# Altium project Zynq-Video-Board-Rev-1.2.PrjPCB (part 1 of 2)
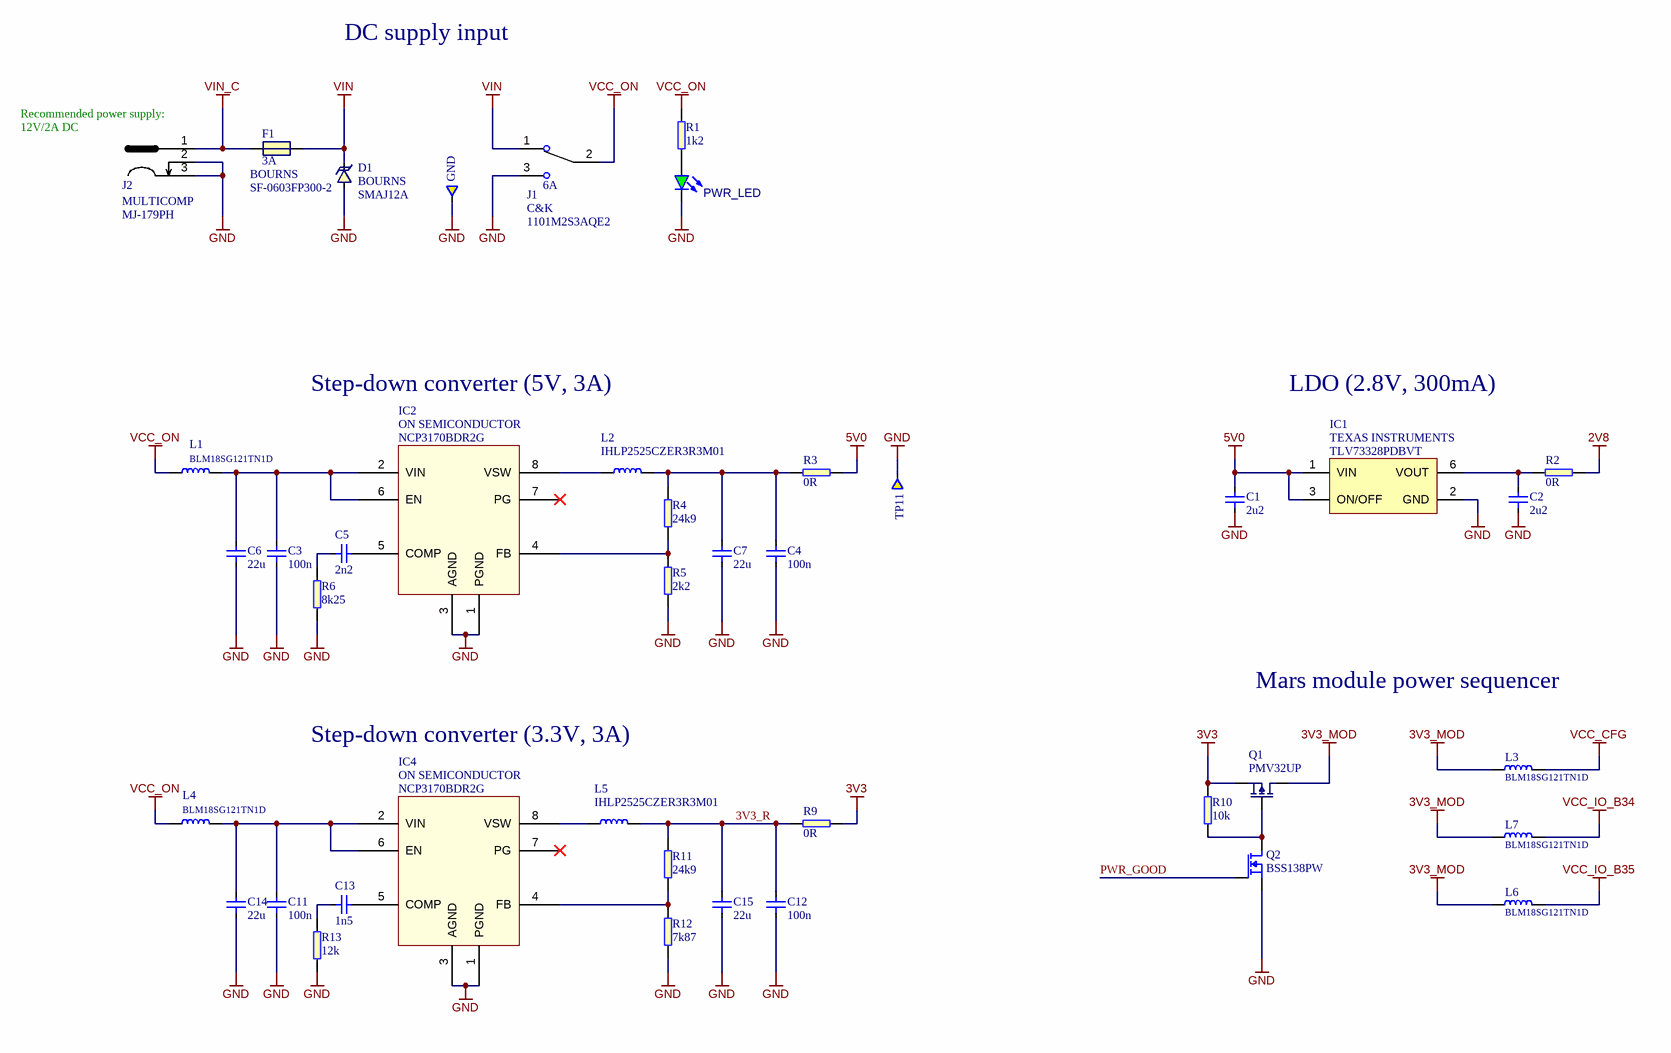
[diagram p0: [1]_Power Supply.SchDoc]
AM_Revision: 1.2; AM_Title: Zynq Video Board
9 sheets, 231 parts. Net scope: global (net labels, ports and power ports of the same name join across sheets).
Board file: Zynq-Video-Board.PcbDoc
Sheets:
  [1]_Power Supply.SchDoc
  [2]_Ethernet_SDCard.SchDoc
  [3]_SO-DIMM.SchDoc
  [4]_USB.SchDoc
  [5]_HDMI.SchDoc
  [6]_Debug.SchDoc
  [7]_CSI.SchDoc
  [8]_Peripherals.SchDoc
  [9]_ID_Serial.SchDoc

## Sheet [1]_Power Supply.SchDoc
size A3; DocumentNumber: 1; SheetNumber: 1; SheetTotal: 9; PageSetup: Record=PageOptions|CenterHorizontal=True|CenterVertical=True|PrintScale=0.97|XCorrection=1.00|YCorrection=1.00|PrintKind=1|BorderSize=5000000|LeftOffset=0|BottomOffset=0|Orientation=2|PaperLength=2970|PaperWidth=2100|Scale=100|PaperSource=7|PrintQuality=600|MediaType=1|DitherType=10|PaperKind=A4|PrintScaleMode=1

### Parts
C1  2u2  [0603]
C2  2u2  [0603]
C3  100n  [0402]
C4  100n  [0402]
C5  2n2  [0402]
C6  22u  [0805]
C7  22u  [0805]
C11  100n  [0402]
C12  100n  [0402]
C13  1n5  [0402]
C14  22u  [0805]
C15  22u  [0805]
D1  SMAJ12A  Manufacturer: BOURNS  [DO-214AA]
F1  3A  Manufacturer: BOURNS  Part Symbol: SF-0603FP300-2  [0603]
GND  Testpad  [TP-R-2]  (value not drawn)  (no BOM)
IC1  TLV73328PDBVT  Manufacturer: TEXAS INSTRUMENTS  [SOT23-5N]
IC2  NCP3170BDR2G  Manufacturer: ON SEMICONDUCTOR  [SOIC-8]
IC4  NCP3170BDR2G  Manufacturer: ON SEMICONDUCTOR  [SOIC-8]
J1  6A  Manufacturer: C&K  [1101M2S3AQE2]
J2  Manufacturer: MULTICOMP  Part Symbol: MJ-179PH  [DC_SOCKET]
L1  BLM18SG121TN1D  [0603]
L2  IHLP2525CZER3R3M01  [IHLP-2525CZ-01]
L3  BLM18SG121TN1D  [0603]
L4  BLM18SG121TN1D  [0603]
L5  IHLP2525CZER3R3M01  [IHLP-2525CZ-01]
L6  BLM18SG121TN1D  [0603]
L7  BLM18SG121TN1D  [0603]
PWR_LED  KPT-1608SGC  [LED0603]  (value not drawn)
Q1  PMV32UP  [SOT-23]
Q2  BSS138PW  [SC70-3]
R1  1k2  [0402]
R2  0R  [0603]
R3  0R  [0603]
R4  24k9  [0402]
R5  2k2  [0402]
R6  8k25  [0402]
R9  0R  [0603]
R10  10k  [0402]
R11  24k9  [0402]
R12  7k87  [0402]
R13  12k  [0402]
TP11  Testpad  [TP-R-2]  (value not drawn)  (no BOM)

### Nets
2V8: R2.2
3V3: Q1.2(S) R9.2 R10.2
3V3_MOD: L3.1 L6.1 L7.1 Q1.3(D)
5V0: C1.2 IC1.1(VIN) IC1.3(ON/OFF) R3.2
GND: C1.1 C2.1 C3.1 C4.1 C6.1 C7.1 C11.1 C12.1 C14.1 C15.1 D1.A GND.1 IC1.2(GND) IC2.1(PGND) IC2.3(AGND) IC4.1(PGND) IC4.3(AGND) J1.3 J2.2 J2.3 PWR_LED.K Q2.2(S) R5.1 R6.1 R12.1 R13.1 TP11.1
VCC_CFG: L3.2
VCC_IO_B34: L7.2
VCC_IO_B35: L6.2
VCC_ON: J1.2 L1.1 L4.1 R1.2
VIN: D1.C F1.2 J1.1
VIN_C: F1.1 J2.1
3V3_R: C12.2 C15.2 L5.2 R9.1 R11.2
PWR_GOOD: Q2.1(G)
NetC2_2: C2.2 IC1.6(VOUT) R2.1
NetC3_2: C3.2 C6.2 IC2.2(VIN) IC2.6(EN) L1.2
NetC4_2: C4.2 C7.2 L2.2 R3.1 R4.2
NetC5_1: C5.1 R6.2
NetC5_2: C5.2 IC2.5(COMP)
NetC11_2: C11.2 C14.2 IC4.2(VIN) IC4.6(EN) L4.2
NetC13_1: C13.1 R13.2
NetC13_2: C13.2 IC4.5(COMP)
NetIC2_4: IC2.4(FB) R4.1 R5.2
NetIC2_8: IC2.8(VSW) L2.1
NetIC4_4: IC4.4(FB) R11.1 R12.2
NetIC4_8: IC4.8(VSW) L5.1
NetPWR_LED_A: PWR_LED.A R1.1
NetQ1_1: Q1.1(G) Q2.3(D) R10.1

Not connected (* = marked no-connect by the designer): IC2 7(PG)*; IC4 7(PG)*

### Notes on the sheet
- DC supply input
- (near J2) Recommended power supply:
- 12V/2A DC
- Step-down converter (5V, 3A)
- LDO (2.8V, 300mA)
- Mars module power sequencer
- Step-down converter (3.3V, 3A)
- Title:
- Size:
- Date:
- A3
- Revision:
- Page:
- of
- Antmicro Ltd.
- File:
- www.antmicro.com

### Library data of the parts
C1 C2 = C_2u2_0603: MLCC SMT Capacitor 2u2F 0603; Manufacturer: TDK; Part Symbol: C1608X5R1V225K080AC; Voltage: 35V; Tolerance: +-10%; Part Number: C_2u2_0603; Value: 2u2
C3 C4 C11 C12 = C_100n_0402: MLCC SMT Capacitor 100nF 0402; Manufacturer: MULTICOMP; Part Symbol: MC0402X104M100CT; Voltage: 10V; Tolerance: +-20%; Part Number: C_100n_0402; Value: 100n
C5 = C_2n2_0402: MLCC SMT Capacitor 2n2 0402; Manufacturer: KEMET; Part Symbol: C0402C222J3GACTU; Voltage: 25V; Tolerance: +-5%; Part Number: C_2n2_0402; Value: 2n2
C6 C7 C14 C15 = C_22u_0805: MLCC SMT Capacitor 22uF 0805; Manufacturer: MULTICOMP; Part Symbol: MC0805X226M6R3CT; Voltage: 6.3V; Tolerance: +-20%; Part Number: C_22u_0805; Value: 22u
C13 = C_1n5_0402: MLCC SMT Capacitor 1.5 nF 0402; Manufacturer: WURTH ELEKTRONIK; Part Symbol: 885012205007; Voltage: 10V; Tolerance: +-10%; Part Number: C_1n5_0402; Value: 1n5
D1 = TVS_UNIDIR: DIODE, TVS, 12V, 400W; Part Number: SMAJ12A; Value: SMAJ12A; Part Symbol: SMAJ12A
F1 = Fuse: Fuse, Surface Mount,  SinglFuse SF-0603FP Series, 3 A, 32 VDC, Fast Acting, 0603; Part Number: SF-0603FP300-2; Value: 3A
GND TP11 = Testpad: Testpad, round, 2mm; Part Number: TP-R-2
IC1 = TLV73328PDBVT: Capacitor-Free, 300-mA, Low-Dropout Regulator with Foldback Current Limit for Portable Devices; Part Number: TLV73328PDBVT; Value: TLV73328PDBVT; Part Symbol: TLV73328PDBVT
IC2 IC4 = NCP3170BDR2G: DC-DC buck (step-down), reg., 4.5V-18Vin, Vou 1.25V-5V/3A, 1 MHz, SOIC-8; Part Number: NCP3170BDR2G; Value: NCP3170BDR2G; Part Symbol: NCP3170BDR2G
J1 = 1101M2S3AQE2: single-pole double-throw (SPDT) PC mount vertical Miniature Slide Switch with right angle through-hole termination; Part Number: SPDT Switch; Value: 6A; Part Symbol: 1101M2S3AQE2
J2 = DC_SOCKET: Part Number: DC_SOCKET
L1 L3 L4 L6 L7 = BLM18SG121TN1D: FERRITE BEAD, 0.025OHM, 3A, 0603; Manufacturer: MURATA; Part Number: BLM18SG121TN1D; Value: BLM18SG121TN1D; Part Symbol: BLM18SG121TN1D
L2 L5 = Inductor Power: 3.3 µH, ± 20%, Shielded, 0.02 ohm, 8 A; Manufacturer: VISHAY; Part Number: IHLP2525CZER3R3M01; Value: IHLP2525CZER3R3M01; Part Symbol: IHLP2525CZER3R3M01
PWR_LED = LED: LED Green 0603 case; Part Number: LED_G; Manufacturer: KINGBRIGHT; Value: KPT-1608SGC; Part Symbol: KPT-1608SGC
Q1 = PMOS: P CH, 20V, 4A; Manufacturer: NXP; Part Number: PMV32UP; Value: PMV32UP; Part Symbol: PMV32UP
Q2 = NMOS: MOSFET, N CH, 60V, 0.2A; Manufacturer: NXP; Value: BSS138PW; Part Number: BSS138PW; Part Symbol: BSS138PW
R1 = R_1k2_0402: SMT Resistor 1k2 0402; Manufacturer: PANASONIC; Part Symbol: ERJ2RKF1201X; Tolerance: 1%; Part Number: R_1k2_0402; Value: 1k2
R2 R3 R9 = R_0R_0603: SMT Resistor 0R 0603; Manufacturer: BOURNS; Part Symbol: CR0603-J/-000ELF; Tolerance: 5%; Part Number: R_0R_0603; Value: 0R
R4 R11 = R_24k9_0402: SMT Resistor 24k9 0402; Manufacturer: WALSIN; Part Symbol: WR04X2492FTL; Tolerance: 1%; Part Number: R_24k9_0402; Value: 24k9
R5 = R_4k7_0402: SMT Resistor 4k7 0402; Manufacturer: PANASONIC ELECTRONIC COMPONENTS; Part Symbol: ERJ2GEJ472X; Tolerance: 5%; Part Number: R_4k7_0402; Value: 2k2
R6 = R_8k25_0402: SMT Resistor 8k25 0402; Manufacturer: PANASONIC; Part Symbol: ERJ2RKF8251X; Tolerance: 1%; Part Number: R_8k25_0402; Value: 8k25
R10 = R_10k_0402: SMT Resistor 10k 0402; Manufacturer: MULTICOMP; Part Symbol: MCMR04X1002FTL; Tolerance: 1%; Part Number: R_10k_0402; Value: 10k
R12 = R_7k87_0402: SMT Resistor 7k87 0402; Manufacturer: MULTICOMP; Part Symbol: MCMR04X7871FTL; Tolerance: 1%; Part Number: R_7k87_0402; Value: 7k87
R13 = R_12k_0402: SMT Resistor 12k 0402; Manufacturer: VISHAY; Part Symbol: CRCW040212K0FKEDHP; Tolerance: 1%; Part Number: R_12k_0402; Value: 12k

## Sheet [2]_Ethernet_SDCard.SchDoc
size A3; DocumentNumber: 2; SheetNumber: 2; SheetTotal: 9; PageSetup: Record=PageOptions|CenterHorizontal=True|CenterVertical=True|PrintScale=0.97|XCorrection=1.00|YCorrection=1.00|PrintKind=1|BorderSize=5000000|LeftOffset=0|BottomOffset=0|Orientation=2|PaperLength=2970|PaperWidth=2100|Scale=100|PaperSource=7|PrintQuality=600|MediaType=1|DitherType=10|PaperKind=A4|PrintScaleMode=1
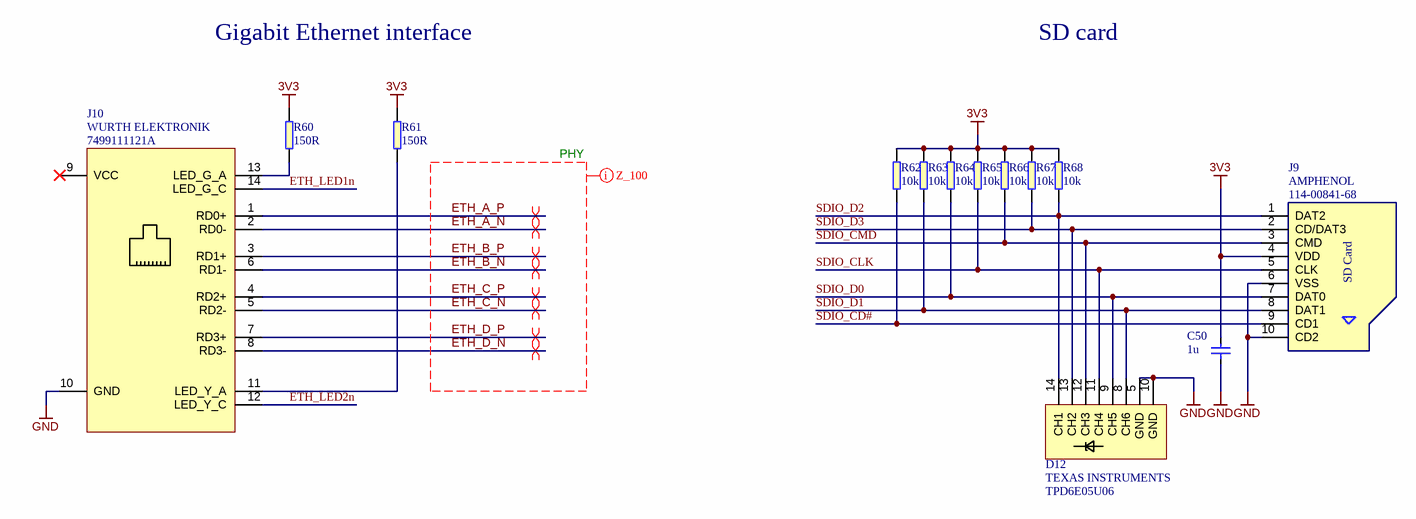
[diagram p1: [2]_Ethernet_SDCard.SchDoc]

### Parts
C50  1u  [0603]
D12  Manufacturer: TEXAS INSTRUMENTS  [TPD6E05U06_PASS]  (hidden comment: TPD6E05U06)
J9  Manufacturer: AMPHENOL  [114-00841-68]  (hidden comment: 114-00841-68)
J10  Manufacturer: WURTH ELEKTRONIK  [WE_7499111121A]  (hidden comment: 7499111121A)
R60  150R  [0402]
R61  150R  [0402]
R62  10k  [0402]
R63  10k  [0402]
R64  10k  [0402]
R65  10k  [0402]
R66  10k  [0402]
R67  10k  [0402]
R68  10k  [0402]

### Nets
3V3: C50.2 J9.4(VDD) R60.2 R61.2 R62.2 R63.2 R64.2 R65.2 R66.2 R67.2 R68.2
GND: C50.1 D12.5(GND) D12.10(GND) J9.6(VSS) J9.10(CD2) J10.10(GND)
ETH_A_N: J10.2(RD0-)
ETH_A_P: J10.1(RD0+)
ETH_B_N: J10.6(RD1-)
ETH_B_P: J10.3(RD1+)
ETH_C_N: J10.5(RD2-)
ETH_C_P: J10.4(RD2+)
ETH_D_N: J10.8(RD3-)
ETH_D_P: J10.7(RD3+)
ETH_LED1n: J10.14(LED_G_C)
ETH_LED2n: J10.12(LED_Y_C)
SDIO_CD#: J9.9(CD1) R62.1
SDIO_CLK: D12.11(CH4) J9.5(CLK) R65.1
SDIO_CMD: D12.12(CH3) J9.3(CMD) R66.1
SDIO_D0: D12.9(CH5) J9.7(DAT0) R64.1
SDIO_D1: D12.8(CH6) J9.8(DAT1) R63.1
SDIO_D2: D12.14(CH1) J9.1(DAT2) R68.1
SDIO_D3: D12.13(CH2) J9.2(CD/DAT3) R67.1
NetJ10_11: J10.11(LED_Y_A) R61.1
NetJ10_13: J10.13(LED_G_A) R60.1

Not connected (* = marked no-connect by the designer): J10 9(VCC)*

### Layout directives
differential pair: ETH_A_N, ETH_A_P, ETH_B_N, ETH_B_P, ETH_C_N, ETH_C_P, ETH_D_N, ETH_D_P
Z_100: 100: ETH_A_N, ETH_A_P, ETH_B_N, ETH_B_P, ETH_C_N, ETH_C_P, ETH_D_N, ETH_D_P

### Notes on the sheet
- Gigabit Ethernet interface
- SD card
- PHY
- Title:
- Size:
- Date:
- A3
- Revision:
- Page:
- of
- Antmicro Ltd.
- File:
- www.antmicro.com
- (in symbol Micro_SD) SD Card

### Library data of the parts
C50 = C_1u_0603: MLCC SMT Capacitor 1u 0603; Manufacturer: MULTICOMP; Part Symbol: MC0603X105M6R3CT; Tolerance: +-20%; Voltage: 6.3V; Value: 1u; Part Number: C_1u_0603
D12 = TPD6E05U06: ESD Suppressors 6-CH Pass through layout; Part Symbol: TPD6E05U06RVZR; Part Number: TPD6E05U06_PASS; Value: TPD6E05U06
J9 = Micro_SD: Micro SD card holder; Part Number: AMP-114-00841-68; Value: 114-00841-68; Part Symbol: 114-00841-68
J10 = WE_7499111121A: CONN MAGJACK 1PORT 1000 BASE-T; Part Number: WE_7499111121A; Value: 7499111121A; Part Symbol: 7499111121A
R60 R61 = R_150R_0402: SMT Resistor 150R_0402; Manufacturer: VISHAY; Part Symbol: CRCW0402150RFKED; Tolerance: 1%; Part Number: R_150R_0402; Value: 150R
R62-R68 = R_10k_0402: as R10 on sheet [1]_Power Supply; Value: 10k; Part Number: R_10k_0402

## Sheet [3]_SO-DIMM.SchDoc
size A3; DocumentNumber: 3; SheetNumber: 3; SheetTotal: 9; PageSetup: Record=PageOptions|CenterHorizontal=True|CenterVertical=True|PrintScale=0.97|XCorrection=1.00|YCorrection=1.00|PrintKind=1|BorderSize=5000000|LeftOffset=0|BottomOffset=0|Orientation=2|PaperLength=2970|PaperWidth=2100|Scale=100|PaperSource=7|PrintQuality=600|MediaType=1|DitherType=10|PaperKind=A4|PrintScaleMode=1
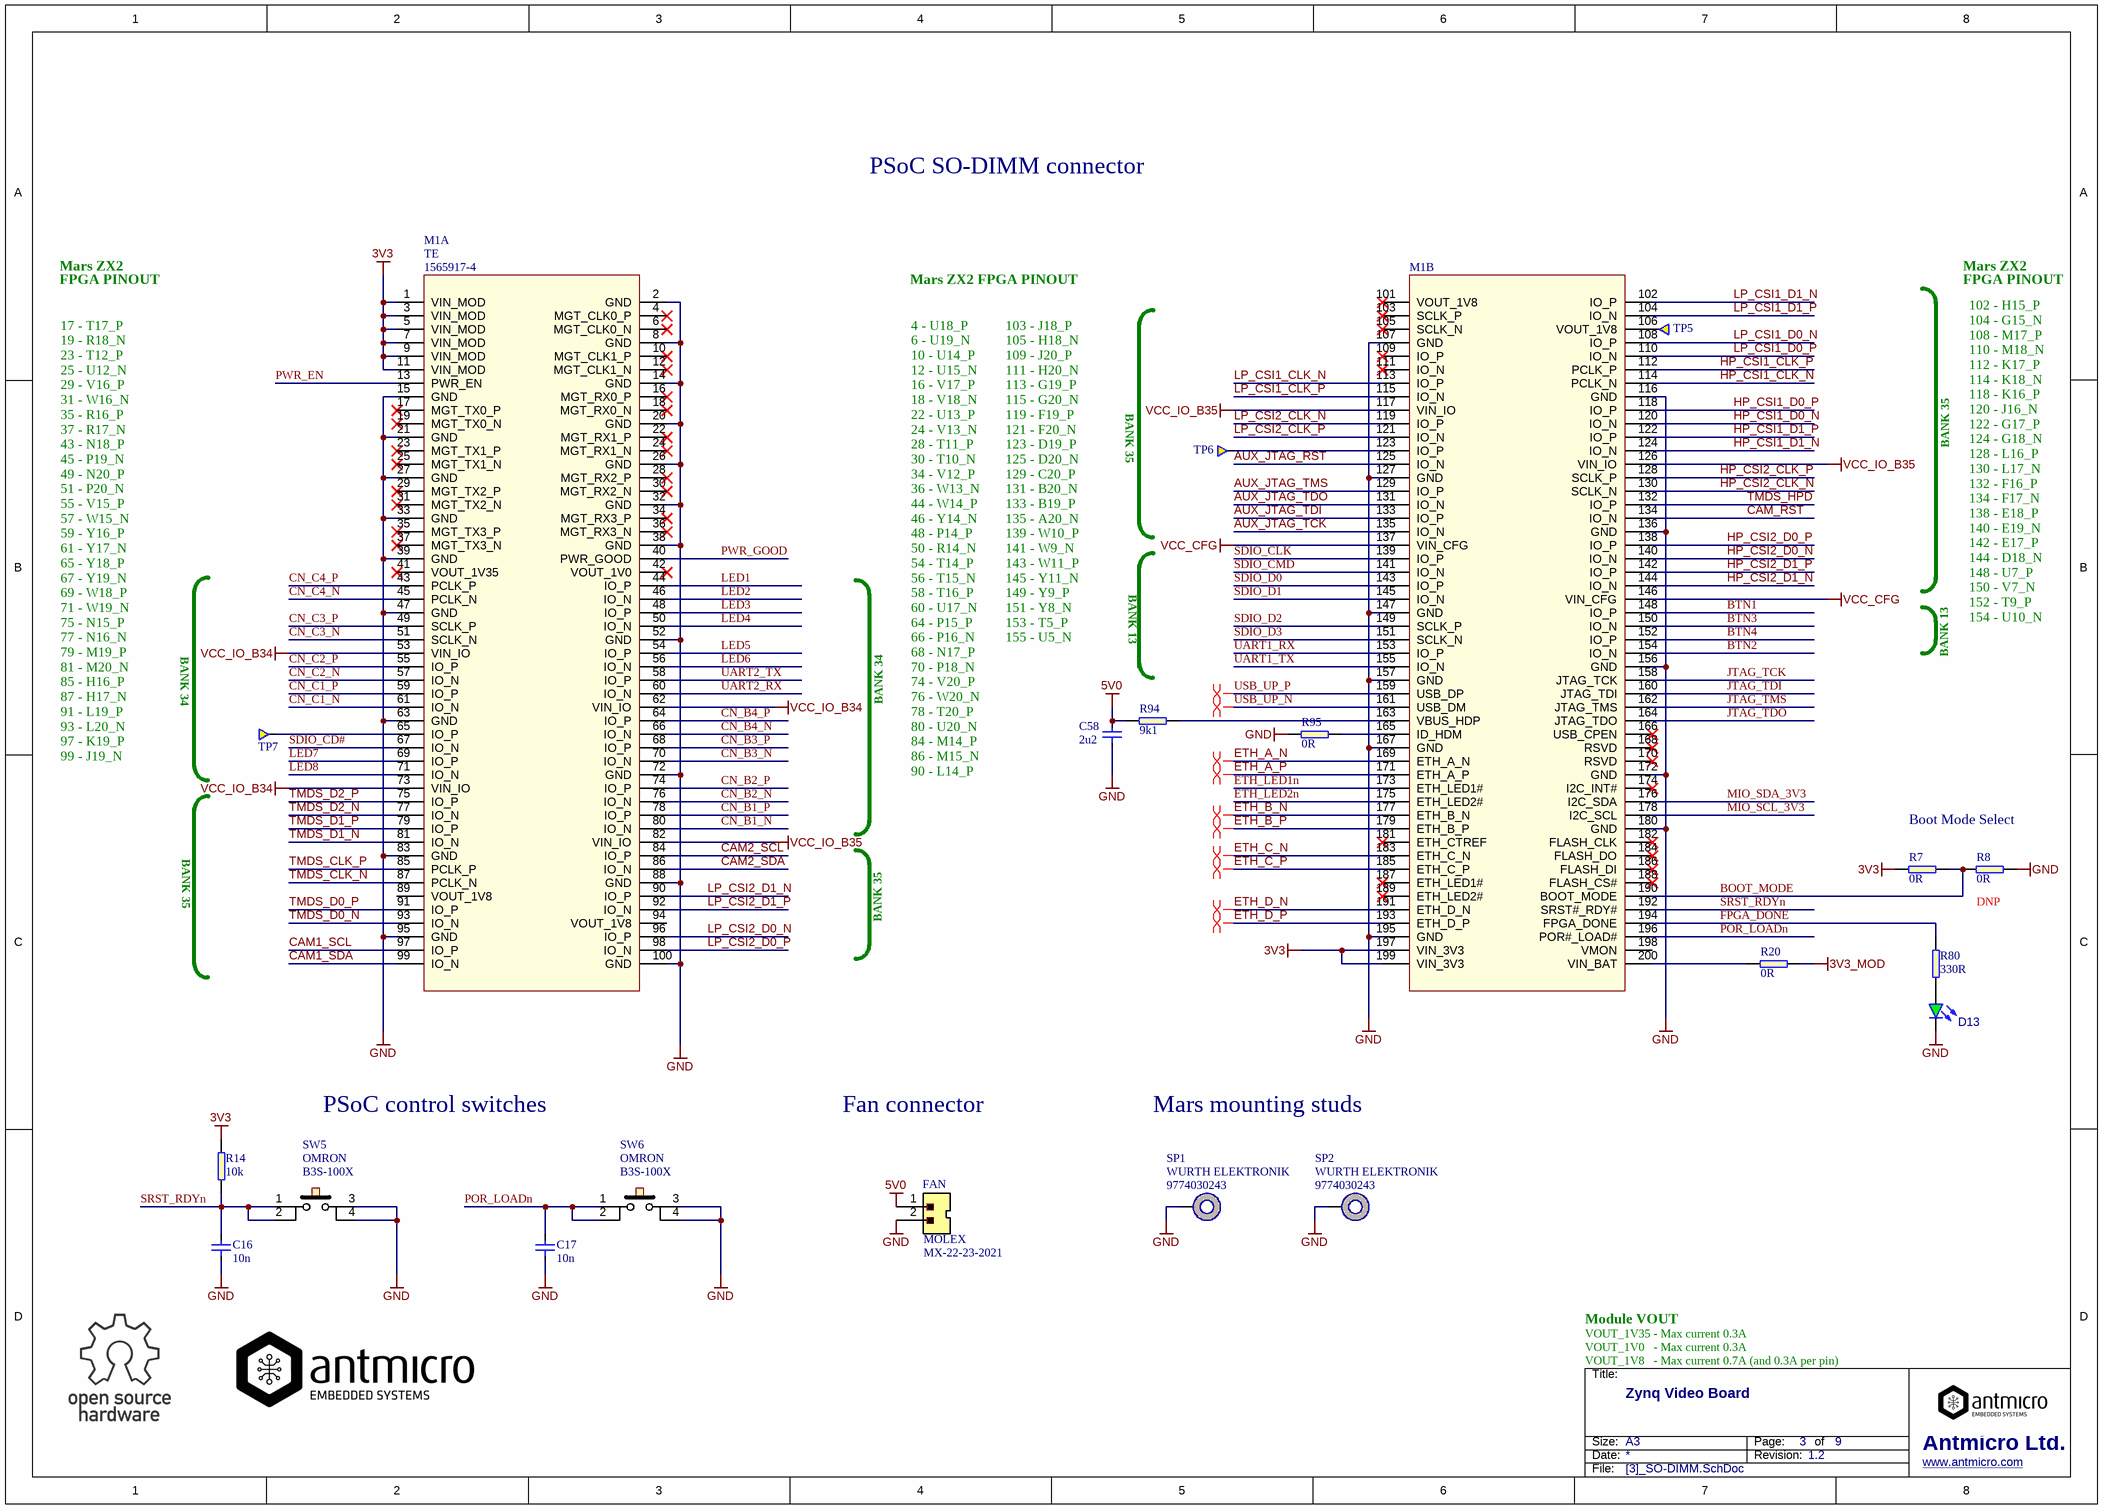
[diagram p2: [3]_SO-DIMM.SchDoc]

### Parts
C16  10n  [0402]
C17  10n  [0402]
C58  2u2  [0603]
D13  KPT-1608SGC  [LED0603]  (value not drawn)
FAN  Manufacturer: MOLEX  [molex_2223-2021]  (hidden comment: MX-22-23-2021)
M1  Manufacturer: TE  [TE_1565917-4]  (hidden comment: 1565917-4)  (parts A,B of 2)
R7  0R  [0402]
R8  0R  [0402]
R14  10k  [0402]
R20  0R  [0402]
R80  330R  [0402]
R94  9k1  [0402]
R95  0R  [0402]
SP1  9774030243  Manufacturer: WURTH ELEKTRONIK  [M2-3mm]
SP2  9774030243  Manufacturer: WURTH ELEKTRONIK  [M2-3mm]
SW5  Manufacturer: OMRON  [B3S-100X]  (hidden comment: B3S-100X)
SW6  Manufacturer: OMRON  [B3S-100X]  (hidden comment: B3S-100X)
TP5  Testpad  [TP-R-2]  (value not drawn)  (no BOM)
TP6  Testpad  [TP-R-2]  (value not drawn)  (no BOM)
TP7  Testpad  [TP-R-2]  (value not drawn)  (no BOM)

### Nets
3V3: M1.1(VIN_MOD) M1.3(VIN_MOD) M1.5(VIN_MOD) M1.7(VIN_MOD) M1.9(VIN_MOD) M1.11(VIN_MOD) M1.197(VIN_3V3) M1.199(VIN_3V3) R7.1 R14.1
3V3_MOD: R20.2
5V0: C58.2 FAN.1 R94.1
GND: C16.1 C17.1 C58.1 D13.K FAN.2 M1.2(GND) M1.8(GND) M1.14(GND) M1.15(GND) M1.20(GND) M1.21(GND) M1.26(GND) M1.27(GND) M1.32(GND) M1.33(GND) M1.38(GND) M1.39(GND) M1.47(GND) M1.52(GND) M1.63(GND) M1.72(GND) M1.83(GND) M1.88(GND) M1.95(GND) M1.100(GND) M1.107(GND) M1.116(GND) M1.127(GND) M1.136(GND) M1.147(GND) M1.156(GND) M1.157(GND) M1.167(GND) M1.172(GND) M1.180(GND) M1.195(GND) R8.2 R95.1 SP1.1 SP2.1 SW5.3 SW5.4 SW6.3 SW6.4
VCC_CFG: M1.137(VIN_CFG) M1.146(VIN_CFG)
VCC_IO_B34: M1.53(VIN_IO) M1.62(VIN_IO) M1.73(VIN_IO)
VCC_IO_B35: M1.82(VIN_IO) M1.117(VIN_IO) M1.126(VIN_IO)
AUX_JTAG_RST: M1.125(IO_N)
AUX_JTAG_TCK: M1.135(IO_N)
AUX_JTAG_TDI: M1.133(IO_P)
AUX_JTAG_TDO: M1.131(IO_N)
AUX_JTAG_TMS: M1.129(IO_P)
BOOT_MODE: M1.190(BOOT_MODE) R7.2 R8.1
BTN1: M1.148(IO_P)
BTN2: M1.154(IO_N)
BTN3: M1.150(IO_N)
BTN4: M1.152(IO_P)
CAM1_SCL: M1.97(IO_P)
CAM1_SDA: M1.99(IO_N)
CAM2_SCL: M1.84(IO_P)
CAM2_SDA: M1.86(IO_N)
CAM_RST: M1.134(IO_N)
CN_B1_N: M1.80(IO_N)
CN_B1_P: M1.78(IO_P)
CN_B2_N: M1.76(IO_N)
CN_B2_P: M1.74(IO_P)
CN_B3_N: M1.70(IO_N)
CN_B3_P: M1.68(IO_P)
CN_B4_N: M1.66(IO_N)
CN_B4_P: M1.64(IO_P)
CN_C1_N: M1.61(IO_N)
CN_C1_P: M1.59(IO_P)
CN_C2_N: M1.57(IO_N)
CN_C2_P: M1.55(IO_P)
CN_C3_N: M1.51(SCLK_N)
CN_C3_P: M1.49(SCLK_P)
CN_C4_N: M1.45(PCLK_N)
CN_C4_P: M1.43(PCLK_P)
ETH_A_N: M1.169(ETH_A_N)
ETH_A_P: M1.171(ETH_A_P)
ETH_B_N: M1.177(ETH_B_N)
ETH_B_P: M1.179(ETH_B_P)
ETH_C_N: M1.183(ETH_C_N)
ETH_C_P: M1.185(ETH_C_P)
ETH_D_N: M1.191(ETH_D_N)
ETH_D_P: M1.193(ETH_D_P)
ETH_LED1n: M1.173(ETH_LED1#)
ETH_LED2n: M1.175(ETH_LED2#)
FPGA_DONE: M1.194(FPGA_DONE) R80.2
HP_CSI1_CLK_N: M1.114(PCLK_N)
HP_CSI1_CLK_P: M1.112(PCLK_P)
HP_CSI1_D0_N: M1.120(IO_N)
HP_CSI1_D0_P: M1.118(IO_P)
HP_CSI1_D1_N: M1.124(IO_N)
HP_CSI1_D1_P: M1.122(IO_P)
HP_CSI2_CLK_N: M1.130(SCLK_N)
HP_CSI2_CLK_P: M1.128(SCLK_P)
HP_CSI2_D0_N: M1.140(IO_N)
HP_CSI2_D0_P: M1.138(IO_P)
HP_CSI2_D1_N: M1.144(IO_N)
HP_CSI2_D1_P: M1.142(IO_P)
JTAG_TCK: M1.158(JTAG_TCK)
JTAG_TDI: M1.160(JTAG_TDI)
JTAG_TDO: M1.164(JTAG_TDO)
JTAG_TMS: M1.162(JTAG_TMS)
LED1: M1.44(IO_P)
LED2: M1.46(IO_N)
LED3: M1.48(IO_P)
LED4: M1.50(IO_N)
LED5: M1.54(IO_P)
LED6: M1.56(IO_N)
LED7: M1.69(IO_P)
LED8: M1.71(IO_N)
LP_CSI1_CLK_N: M1.113(IO_P)
LP_CSI1_CLK_P: M1.115(IO_N)
LP_CSI1_D0_N: M1.108(IO_P)
LP_CSI1_D0_P: M1.110(IO_N)
LP_CSI1_D1_N: M1.102(IO_P)
LP_CSI1_D1_P: M1.104(IO_N)
LP_CSI2_CLK_N: M1.119(IO_P)
LP_CSI2_CLK_P: M1.121(IO_N)
LP_CSI2_D0_N: M1.96(IO_P)
LP_CSI2_D0_P: M1.98(IO_N)
LP_CSI2_D1_N: M1.90(IO_P)
LP_CSI2_D1_P: M1.92(IO_N)
MIO_SCL_3V3: M1.178(I2C_SCL)
MIO_SDA_3V3: M1.176(I2C_SDA)
POR_LOADn: C17.2 M1.196(POR#_LOAD#) SW6.1 SW6.2
PWR_EN: M1.13(PWR_EN)
PWR_GOOD: M1.40(PWR_GOOD)
SDIO_CD#: M1.67(IO_N)
SDIO_CLK: M1.139(IO_P)
SDIO_CMD: M1.141(IO_N)
SDIO_D0: M1.143(IO_P)
SDIO_D1: M1.145(IO_N)
SDIO_D2: M1.149(SCLK_P)
SDIO_D3: M1.151(SCLK_N)
SRST_RDYn: C16.2 M1.192(SRST#_RDY#) R14.2 SW5.1 SW5.2
TMDS_CLK_N: M1.87(PCLK_N)
TMDS_CLK_P: M1.85(PCLK_P)
TMDS_D0_N: M1.93(IO_N)
TMDS_D0_P: M1.91(IO_P)
TMDS_D1_N: M1.81(IO_N)
TMDS_D1_P: M1.79(IO_P)
TMDS_D2_N: M1.77(IO_N)
TMDS_D2_P: M1.75(IO_P)
TMDS_HPD: M1.132(IO_P)
UART1_RX: M1.153(IO_P)
UART1_TX: M1.155(IO_N)
UART2_RX: M1.60(IO_N)
UART2_TX: M1.58(IO_P)
USB_UP_N: M1.161(USB_DM)
USB_UP_P: M1.159(USB_DP)
NetD13_A: D13.A R80.1
NetM1_65: M1.65(IO_P) TP7.1
NetM1_106: M1.106(VOUT_1V8) TP5.1
NetM1_123: M1.123(IO_P) TP6.1
NetM1_163: M1.163(VBUS_HDP) R94.2
NetM1_165: M1.165(ID_HDM) R95.2
NetM1_200: M1.200(VIN_BAT) R20.1

Not connected (* = marked no-connect by the designer): M1 4(MGT_CLK0_P)* 6(MGT_CLK0_N)* 10(MGT_CLK1_P)* 12(MGT_CLK1_N)* 16(MGT_RX0_P)* 17(MGT_TX0_P)* 18(MGT_RX0_N)* 19(MGT_TX0_N)* 22(MGT_RX1_P)* 23(MGT_TX1_P)* 24(MGT_RX1_N)* 25(MGT_TX1_N)* 28(MGT_RX2_P)* 29(MGT_TX2_P)* 30(MGT_RX2_N)* 31(MGT_TX2_N)* 34(MGT_RX3_P)* 35(MGT_TX3_P)* 36(MGT_RX3_N)* 37(MGT_TX3_N)* 41(VOUT_1V35)* 42(VOUT_1V0)* 89(VOUT_1V8) 94(VOUT_1V8) 101(VOUT_1V8)* 103(SCLK_P)* 105(SCLK_N)* 109(IO_P)* 111(IO_N)* 166(USB_CPEN)* 168(RSVD)* 170(RSVD)* 174(I2C_INT#)* 181(ETH_CTREF)* 182(FLASH_CLK)* 184(FLASH_DO)* 186(FLASH_DI)* 187(ETH_LED1#)* 188(FLASH_CS#)* 189(ETH_LED2#)* 198(VMON)

### Layout directives
differential pair: ETH_A_N, ETH_A_P, ETH_B_N, ETH_B_P, ETH_C_N, ETH_C_P, ETH_D_N, ETH_D_P, USB_UP_N, USB_UP_P

### Notes on the sheet
- PSoC SO-DIMM connector
- Mars ZX2
- FPGA PINOUT
- Mars ZX2 FPGA PINOUT
- BANK 35
- BANK 34
- BANK 13
- 102 - H15_P
  104 - G15_N
  108 - M17_P
  110 - M18_N
  112 - K17_P
  114 - K18_N
  118 - K16_P
  120 - J16_N
  122 - G17_P
  124 - G18_N
  128 - L16_P
  130 - L17_N
  132 - F16_P
  134 - F17_N
  138 - E18_P
  140 - E19_N
  142 - E17_P
  144 - D18_N
  148 - U7_P
  150 - V7_N
  152 - T9_P
  154 - U10_N
- 17 - T17_P
  19 - R18_N
  23 - T12_P
  25 - U12_N
  29 - V16_P
  31 - W16_N
  35 - R16_P
  37 - R17_N
  43 - N18_P
  45 - P19_N
  49 - N20_P
  51 - P20_N
  55 - V15_P
  57 - W15_N
  59 - Y16_P
  61 - Y17_N
  65 - Y18_P
  67 - Y19_N
  69 - W18_P
  71 - W19_N
  75 - N15_P
  77 - N16_N
  79 - M19_P
  81 - M20_N
  85 - H16_P
  87 - H17_N
  91 - L19_P
  93 - L20_N
  97 - K19_P
  99 - J19_N
- 4 - U18_P
  6 - U19_N
  10 - U14_P
  12 - U15_N
  16 - V17_P
  18 - V18_N
  22 - U13_P
  24 - V13_N
  28 - T11_P
  30 - T10_N
  34 - V12_P
  36 - W13_N
  44 - W14_P
  46 - Y14_N
  48 - P14_P
  50 - R14_N
  54 - T14_P
  56 - T15_N
  58 - T16_P
  60 - U17_N
  64 - P15_P
  66 - P16_N
  68 - N17_P
  70 - P18_N
  74 - V20_P
  76 - W20_N
  78 - T20_P
  80 - U20_N
  84 - M14_P
  86 - M15_N
  90 - L14_P
  92 - L15_N
  96 - K14_P
  98 - J14_N
- (near C58) 103 - J18_P
  105 - H18_N
  109 - J20_P
  111 - H20_N
  113 - G19_P
  115 - G20_N
  119 - F19_P
  121 - F20_N
  123 - D19_P
  125 - D20_N
  129 - C20_P
  131 - B20_N
  133 - B19_P
  135 - A20_N
  139 - W10_P
  141 - W9_N
  143 - W11_P
  145 - Y11_N
  149 - Y9_P
  151 - Y8_N
  153 - T5_P
  155 - U5_N
- Boot Mode Select
- (near R8) DNP
- PSoC control switches
- Fan connector
- Mars mounting studs
- Module VOUT
- VOUT_1V35 - Max current 0.3A
- VOUT_1V0   - Max current 0.3A
- VOUT_1V8   - Max current 0.7A (and 0.3A per pin)
- Title:
- Size:
- Date:
- A3
- Revision:
- Page:
- of
- Antmicro Ltd.
- File:
- www.antmicro.com

### Library data of the parts
C16 C17 = C_10n_0402: MLCC SMT Capacitor 10nF 0402; Manufacturer: AVX; Part Symbol: 04025G103ZAT2A; Voltage: 50V; Tolerance: +80% -20%; Part Number: C_10n_0402; Value: 10n
C58 = C_2u2_0603: as C1 on sheet [1]_Power Supply; Part Number: C_2u2_0603; Value: 2u2
D13 = LED: as PWR_LED on sheet [1]_Power Supply; Value: KPT-1608SGC; Part Symbol: KPT-1608SGC
FAN = molex_2223-2021: Pinhead connector with key; Part Symbol: 022232021 A-6373-02A222; Part Number: molex_2223-2021; Value: MX-22-23-2021
M1 = Mars ZX2: SODIMM Connector 200_1V8; Part Number: Mars ZX2; Part Symbol: 1565917-4; Value: 1565917-4
R7 R8 R20 R95 = R_0R_0402: SMT Resistor 0R 0402; Manufacturer: MULTICOMP; Part Symbol: MCMR04X000 PTL; Part Number: R_0R_0402; Value: 0R
R14 = R_10k_0402: as R10 on sheet [1]_Power Supply; Part Number: R_10k_0402; Value: 10k
R80 = R_330R_0402: SMT Resistor 330R 0402; Manufacturer: MULTICOMP; Part Symbol: MCMR04X3300FTL; Tolerance: 1%; Part Number: R_330R_0402; Value: 330R
R94 = R_9k1_0402: SMT Resistor 9k1 0402; Manufacturer: YAGEO; Part Symbol: RC0402FR-079K1L; Tolerance: 1%; Part Number: R_9k1_0402; Value: 9k1
SP1 SP2 = SPACER: M2x3; Part Number: WE_9774030243; Value: 9774030243; Part Symbol: 9774030243
SW5 SW6 = TACTILE_SWITCH: Tactile switch; Part Number: B3S-1002; Value: B3S-100X; Part Symbol: B3S-1002
TP5-TP7 = Testpad: Testpad, round, 2mm; Part Number: TP-R-2

## Sheet [4]_USB.SchDoc
size A3; DocumentNumber: 4; SheetNumber: 4; SheetTotal: 9; PageSetup: Record=PageOptions|CenterHorizontal=True|CenterVertical=True|PrintScale=0.97|XCorrection=1.00|YCorrection=1.00|PrintKind=1|BorderSize=5000000|LeftOffset=0|BottomOffset=0|Orientation=2|PaperLength=2970|PaperWidth=2100|Scale=100|PaperSource=7|PrintQuality=600|MediaType=1|DitherType=10|PaperKind=A4|PrintScaleMode=1
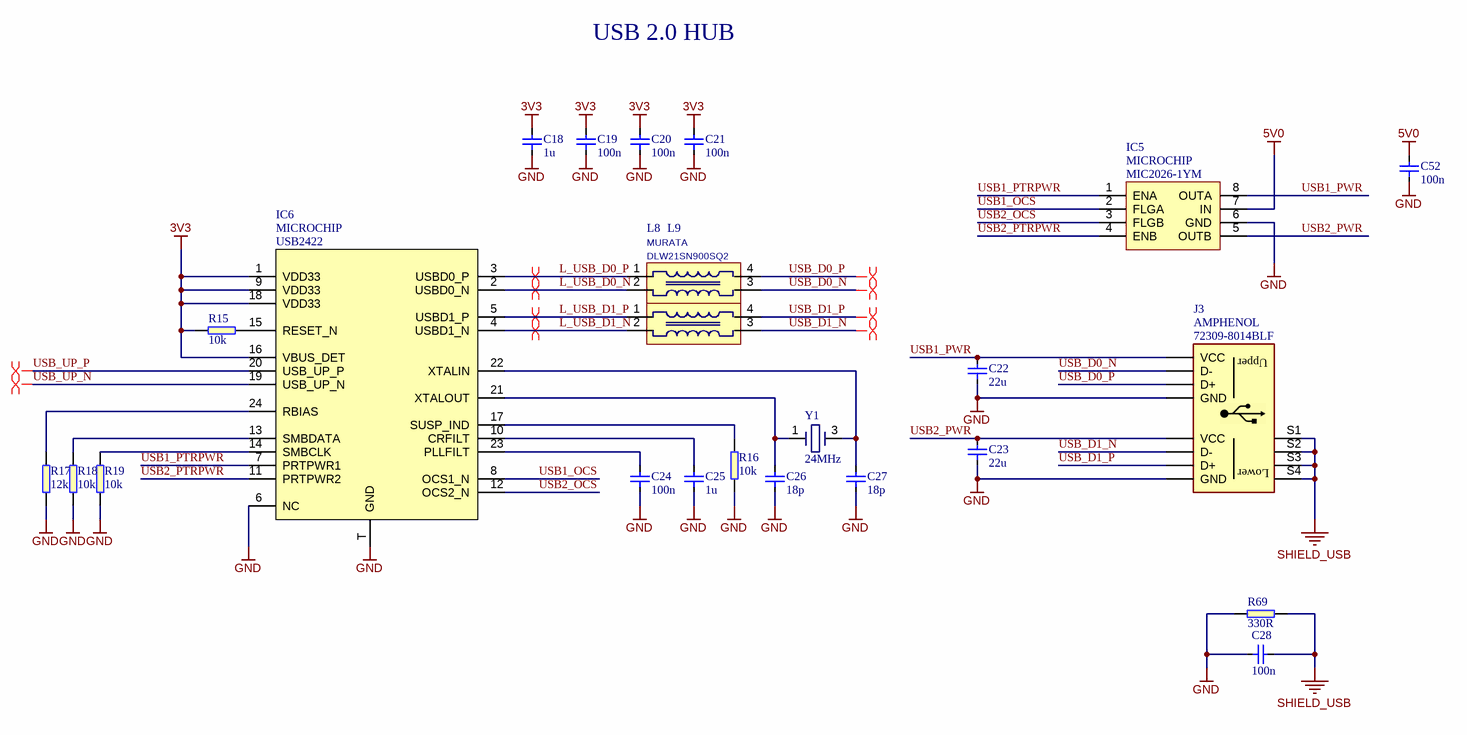
[diagram p3: [4]_USB.SchDoc]

### Parts
C18  1u  [0603]
C19  100n  [0402]
C20  100n  [0402]
C21  100n  [0402]
C22  22u  [0805]
C23  22u  [0805]
C24  100n  [0402]
C25  1u  [0603]
C26  18p  [0402]
C27  18p  [0402]
C28  100n  [0402]
C52  100n  [0402]
IC5  Manufacturer: MICROCHIP  [SOIC-8]  (hidden comment: MIC2026-1YM)
IC6  USB2422  Manufacturer: MICROCHIP  [QFN24]
J3  Manufacturer: AMPHENOL  Part Symbol: 72309-8014BLF  [T_MMMC_896-43-008-90-000000]
L8  Manufacturer: MURATA  [DLW21SN900SQ2]  (hidden comment: DLW21SN900SQ2)
L9  DLW21SN900SQ2  [DLW21SN900SQ2]  (value not drawn)
R15  10k  [0402]
R16  10k  [0402]
R17  12k  [0402]
R18  10k  [0402]
R19  10k  [0402]
R69  330R  [0402]
Y1  24MHz  [X1E0000210832]

### Nets
3V3: C18.2 C19.2 C20.2 C21.2 IC6.1(VDD33) IC6.9(VDD33) IC6.16(VBUS_DET) IC6.18(VDD33) R15.1
5V0: C52.2 IC5.7(IN)
GND: C18.1 C19.1 C20.1 C21.1 C22.1 C23.1 C24.1 C25.1 C26.1 C27.1 C28.1 C52.1 IC5.6(GND) IC6.6(NC) IC6.T(GND) J3.L4(GND) J3.U4(GND) R16.2 R17.1 R18.2 R19.2 R69.1 Y1.2 Y1.4
SHIELD_USB: C28.2 J3.S1 J3.S2 J3.S3 J3.S4 R69.2
L_USB_D0_N: IC6.2(USBD0_N) L8.2
L_USB_D0_P: IC6.3(USBD0_P) L8.1
L_USB_D1_N: IC6.4(USBD1_N) L9.2
L_USB_D1_P: IC6.5(USBD1_P) L9.1
USB1_OCS: IC5.2(FLGA) IC6.8(OCS1_N)
USB1_PTRPWR: IC5.1(ENA) IC6.7(PRTPWR1)
USB1_PWR: C22.2 IC5.8(OUTA) J3.U1(VCC)
USB2_OCS: IC5.3(FLGB) IC6.12(OCS2_N)
USB2_PTRPWR: IC5.4(ENB) IC6.11(PRTPWR2)
USB2_PWR: C23.2 IC5.5(OUTB) J3.L1(VCC)
USB_D0_N: J3.U2(D-) L8.3
USB_D0_P: J3.U3(D+) L8.4
USB_D1_N: J3.L2(D-) L9.3
USB_D1_P: J3.L3(D+) L9.4
USB_UP_N: IC6.19(USB_UP_N)
USB_UP_P: IC6.20(USB_UP_P)
NetC24_2: C24.2 IC6.23(PLLFILT)
NetC25_2: C25.2 IC6.10(CRFILT)
NetC26_2: C26.2 IC6.21(XTALOUT) Y1.1
NetC27_2: C27.2 IC6.22(XTALIN) Y1.3
NetIC6_13: IC6.13(SMBDATA) R18.1
NetIC6_14: IC6.14(SMBCLK) R19.1
NetIC6_15: IC6.15(RESET_N) R15.2
NetIC6_17: IC6.17(SUSP_IND) R16.1
NetIC6_24: IC6.24(RBIAS) R17.2

### Layout directives
differential pair: L_USB_D0_N, L_USB_D0_P, L_USB_D1_N, L_USB_D1_P, USB_D0_N, USB_D0_P, USB_D1_N, USB_D1_P, USB_UP_N, USB_UP_P

### Notes on the sheet
- USB 2.0 HUB
- Title:
- Size:
- Date:
- A3
- Revision:
- Page:
- of
- Antmicro Ltd.
- File:
- www.antmicro.com
- (in symbol USB_DOUBLE_A) Upper; Lower

### Library data of the parts
C18 C25 = C_1u_0603: MLCC SMT Capacitor 1u 0603; Manufacturer: MULTICOMP; Part Symbol: MC0603X105M6R3CT; Voltage: 6.3V; Tolerance: +-20%; Part Number: C_1u_0603; Value: 1u
C19-C21 C24 C28 C52 = C_100n_0402: as C3 on sheet [1]_Power Supply; Value: 100n; Part Number: C_100n_0402
C22 C23 = C_22u_0805: as C6 on sheet [1]_Power Supply; Part Number: C_22u_0805; Value: 22u
C26 C27 = C_18p_0402: MLCC SMT Capacitor 18pF 0402; Manufacturer: KEMET; Part Symbol: C0402C180J5GACAUTO; Voltage: 50V; Tolerance: +-5%; Part Number: C_18p_0402; Value: 18p
IC5 = MIC2026-1YM: Power Load Distribution Switch IC, Active High, 2 Outputs, 5.5 V in, 900 mA, 0.09 ohm, SOIC-8; Part Number: MIC2026-1YM; Value: MIC2026-1YM; Part Symbol: MIC2026-1YM
IC6 = USB2422: The USB2422-I/MJ is a 2-port USB 2.0 high-speed Hub Controller IC with two downstream ports for embedded USB solutions.; Part Number: USB2422; Value: USB2422; Part Symbol: USB2422-I/MJ
J3 = USB_DOUBLE_A: 8-way 2-port USB 2.0 type-A Stacked Connector with gold-plated copper alloy contacts.; Part Number: USB_DOUBLE_A
L8 = DLW21SN900SQ2: Common mode choke; Part Symbol: DLW21SN900SQ2L; Part Number: DLW21SN900SQ2; Value: DLW21SN900SQ2
L9 = DLW21SN900SQ2: Common mode choke; Manufacturer: MURATA; Part Symbol: DLW21SN900SQ2L; Part Number: DLW21SN900SQ2; Value: DLW21SN900SQ2
R15 R16 R18 R19 = R_10k_0402: as R10 on sheet [1]_Power Supply; Part Number: R_10k_0402; Value: 10k
R17 = R_12k_0402: as R13 on sheet [1]_Power Supply; Part Number: R_12k_0402; Value: 12k
R69 = R_330R_0402: as R80 on sheet [3]_SO-DIMM; Part Number: R_330R_0402; Value: 330R
Y1 = CRYSTAL_SMD_24Mhz: Crystal, 24 MHz, SMD, 3.2mm x 2.5mm, 10 ppm, 18 pF, 10 ppm, TSX-3225 Series; Part Number: CRYSTAL_24MHz_3.2mm x2.5mm; Manufacturer: EPSON; Part Symbol: X1E0000210832 TSX-3225 24MHZ; Value: 24MHz

## Sheet [5]_HDMI.SchDoc
size A3; DocumentNumber: 5; SheetNumber: 5; SheetTotal: 9; PageSetup: Record=PageOptions|CenterHorizontal=True|CenterVertical=True|PrintScale=0.97|XCorrection=1.00|YCorrection=1.00|PrintKind=1|BorderSize=5000000|LeftOffset=0|BottomOffset=0|Orientation=2|PaperLength=2970|PaperWidth=2100|Scale=100|PaperSource=7|PrintQuality=600|MediaType=1|DitherType=10|PaperKind=A4|PrintScaleMode=1
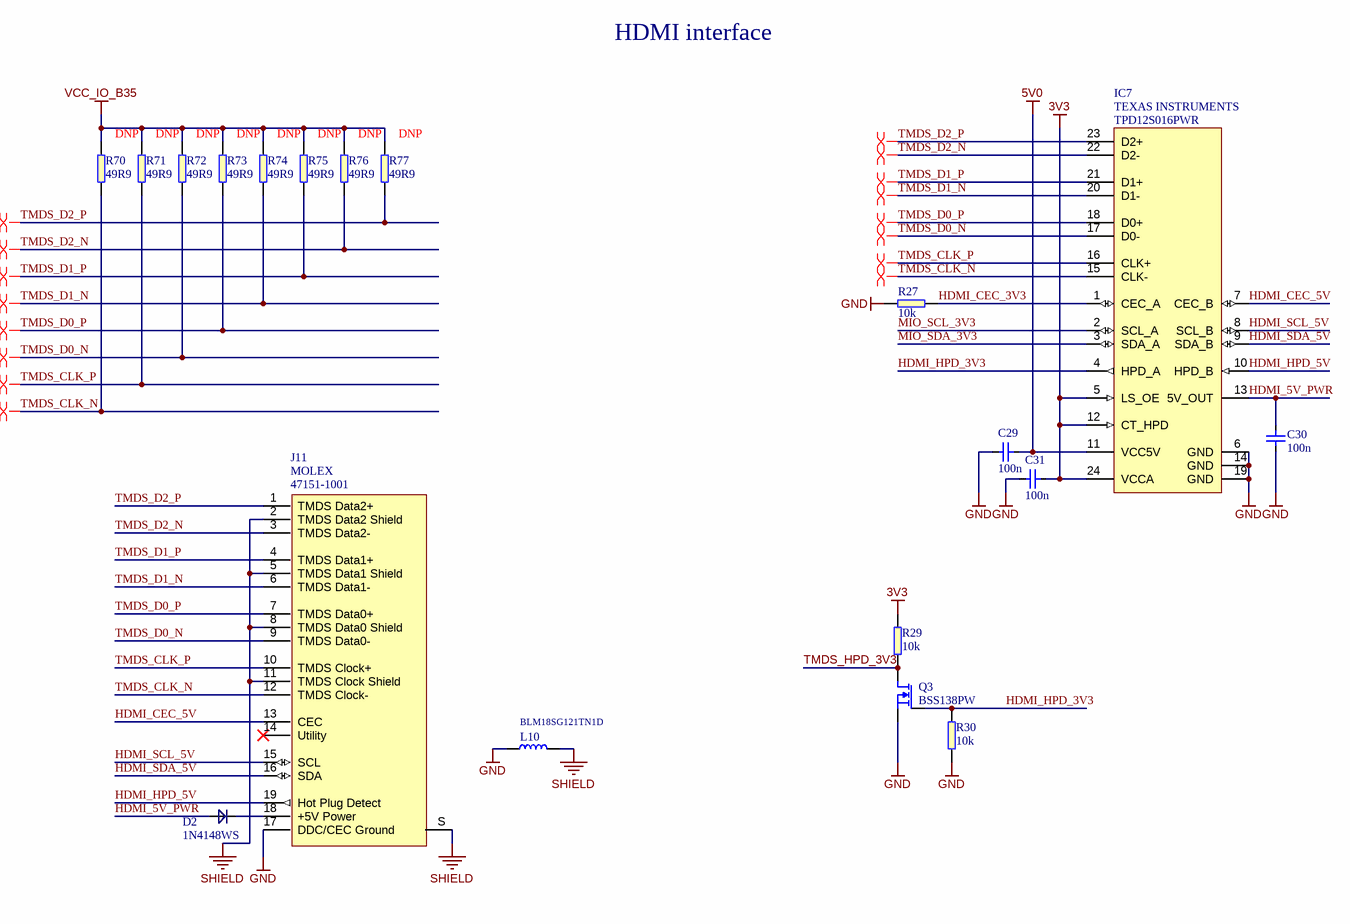
[diagram p4: [5]_HDMI.SchDoc]

### Parts
C29  100n  [0402]
C30  100n  [0402]
C31  100n  [0402]
D2  1N4148WS  [SOD-323]
IC7  TPD12S016PWR  Manufacturer: TEXAS INSTRUMENTS  [TSOP65P640X120-24L]
J11  47151-1001  Manufacturer: MOLEX  [Molex_HDMI_471511001]
L10  BLM18SG121TN1D  [0603]
Q3  BSS138PW  [SC70-3]
R27  10k  [0402]
R29  10k  [0402]
R30  10k  [0402]
R70  49R9  [0402]
R71  49R9  [0402]
R72  49R9  [0402]
R73  49R9  [0402]
R74  49R9  [0402]
R75  49R9  [0402]
R76  49R9  [0402]
R77  49R9  [0402]

### Nets
3V3: C31.1 IC7.5(LS_OE) IC7.12(CT_HPD) IC7.24(VCCA) R29.2
5V0: C29.1 IC7.11(VCC5V)
GND: C29.2 C30.2 C31.2 IC7.6(GND) IC7.14(GND) IC7.19(GND) J11.17(DDC/CEC_Ground) L10.1 Q3.2(S) R27.1 R30.1
SHIELD: J11.2(TMDS_Data2_Shield) J11.5(TMDS_Data1_Shield) J11.8(TMDS_Data0_Shield) J11.11(TMDS_Clock_Shield) J11.S(SH) L10.2
VCC_IO_B35: R70.2 R71.2 R72.2 R73.2 R74.2 R75.2 R76.2 R77.2
HDMI_5V_PWR: C30.1 D2.A IC7.13(5V_OUT)
HDMI_CEC_3V3: IC7.1(CEC_A) R27.2
HDMI_CEC_5V: IC7.7(CEC_B) J11.13(CEC)
HDMI_HPD_3V3: IC7.4(HPD_A) Q3.1(G) R30.2
HDMI_HPD_5V: IC7.10(HPD_B) J11.19(Hot_Plug_Detect)
HDMI_SCL_5V: IC7.8(SCL_B) J11.15(SCL)
HDMI_SDA_5V: IC7.9(SDA_B) J11.16(SDA)
MIO_SCL_3V3: IC7.2(SCL_A)
MIO_SDA_3V3: IC7.3(SDA_A)
TMDS_CLK_N: IC7.15(CLK-) J11.12(TMDS_Clock-) R70.1
TMDS_CLK_P: IC7.16(CLK+) J11.10(TMDS_Clock+) R71.1
TMDS_D0_N: IC7.17(D0-) J11.9(TMDS_Data0-) R72.1
TMDS_D0_P: IC7.18(D0+) J11.7(TMDS_Data0+) R73.1
TMDS_D1_N: IC7.20(D1-) J11.6(TMDS_Data1-) R74.1
TMDS_D1_P: IC7.21(D1+) J11.4(TMDS_Data1+) R75.1
TMDS_D2_N: IC7.22(D2-) J11.3(TMDS_Data2-) R76.1
TMDS_D2_P: IC7.23(D2+) J11.1(TMDS_Data2+) R77.1
TMDS_HPD_3V3: Q3.3(D) R29.1
NetD2_C: D2.C J11.18(+5V_Power)

Not connected (* = marked no-connect by the designer): J11 14(Utility)*

### Layout directives
differential pair: TMDS_CLK_N, TMDS_CLK_P, TMDS_D0_N, TMDS_D0_P, TMDS_D1_N, TMDS_D1_P, TMDS_D2_N, TMDS_D2_P

### Notes on the sheet
- HDMI interface
- DNP
- (near R77) DNP
- Title:
- Size:
- Date:
- A3
- Revision:
- Page:
- of
- Antmicro Ltd.
- File:
- www.antmicro.com

### Library data of the parts
C29-C31 = C_100n_0402: as C3 on sheet [1]_Power Supply; Value: 100n; Part Number: C_100n_0402
D2 = 1N4148WS: Diode small signal; Manufacturer: ON SEMICONDUCTOR; Part Number: 1N4148WS; Value: 1N4148WS; Part Symbol: 1N4148WS
IC7 = TPD12S016PWR: TPD12S016PWR is a single-chip High Definition Multimedia Interface (HDMI); Part Number: TPD12S016PWR; Value: TPD12S016PWR; Part Symbol: TPD12S016PWR
J11 = CON-Molex-471511001: Header right angle HDMI; Part Number: CON-Molex-471511001; Value: 47151-1001; Part Symbol: 47151-1001
L10 = BLM18SG121TN1D: as L1 on sheet [1]_Power Supply; Part Number: BLM18SG121TN1D; Value: BLM18SG121TN1D; Part Symbol: BLM18SG121TN1D
Q3 = NMOS: as Q2 on sheet [1]_Power Supply; Value: BSS138PW; Part Number: BSS138PW; Part Symbol: BSS138PW
R27 R29 R30 = R_10k_0402: as R10 on sheet [1]_Power Supply; Part Number: R_10k_0402; Value: 10k
R70-R77 = R_49R9_0402: SMT Resistor 49R9 0402; Manufacturer: VISHAY; Part Symbol: CRCW040249R9FKED; Tolerance: 1%; Part Number: R_49R9_0402; Value: 49R9

## Sheet [6]_Debug.SchDoc
size A3; DocumentNumber: 6; SheetNumber: 6; SheetTotal: 9; PageSetup: Record=PageOptions|CenterHorizontal=True|CenterVertical=True|PrintScale=0.97|XCorrection=1.00|YCorrection=1.00|PrintKind=1|BorderSize=5000000|LeftOffset=0|BottomOffset=0|Orientation=2|PaperLength=2970|PaperWidth=2100|Scale=100|PaperSource=7|PrintQuality=600|MediaType=1|DitherType=10|PaperKind=A4|PrintScaleMode=1
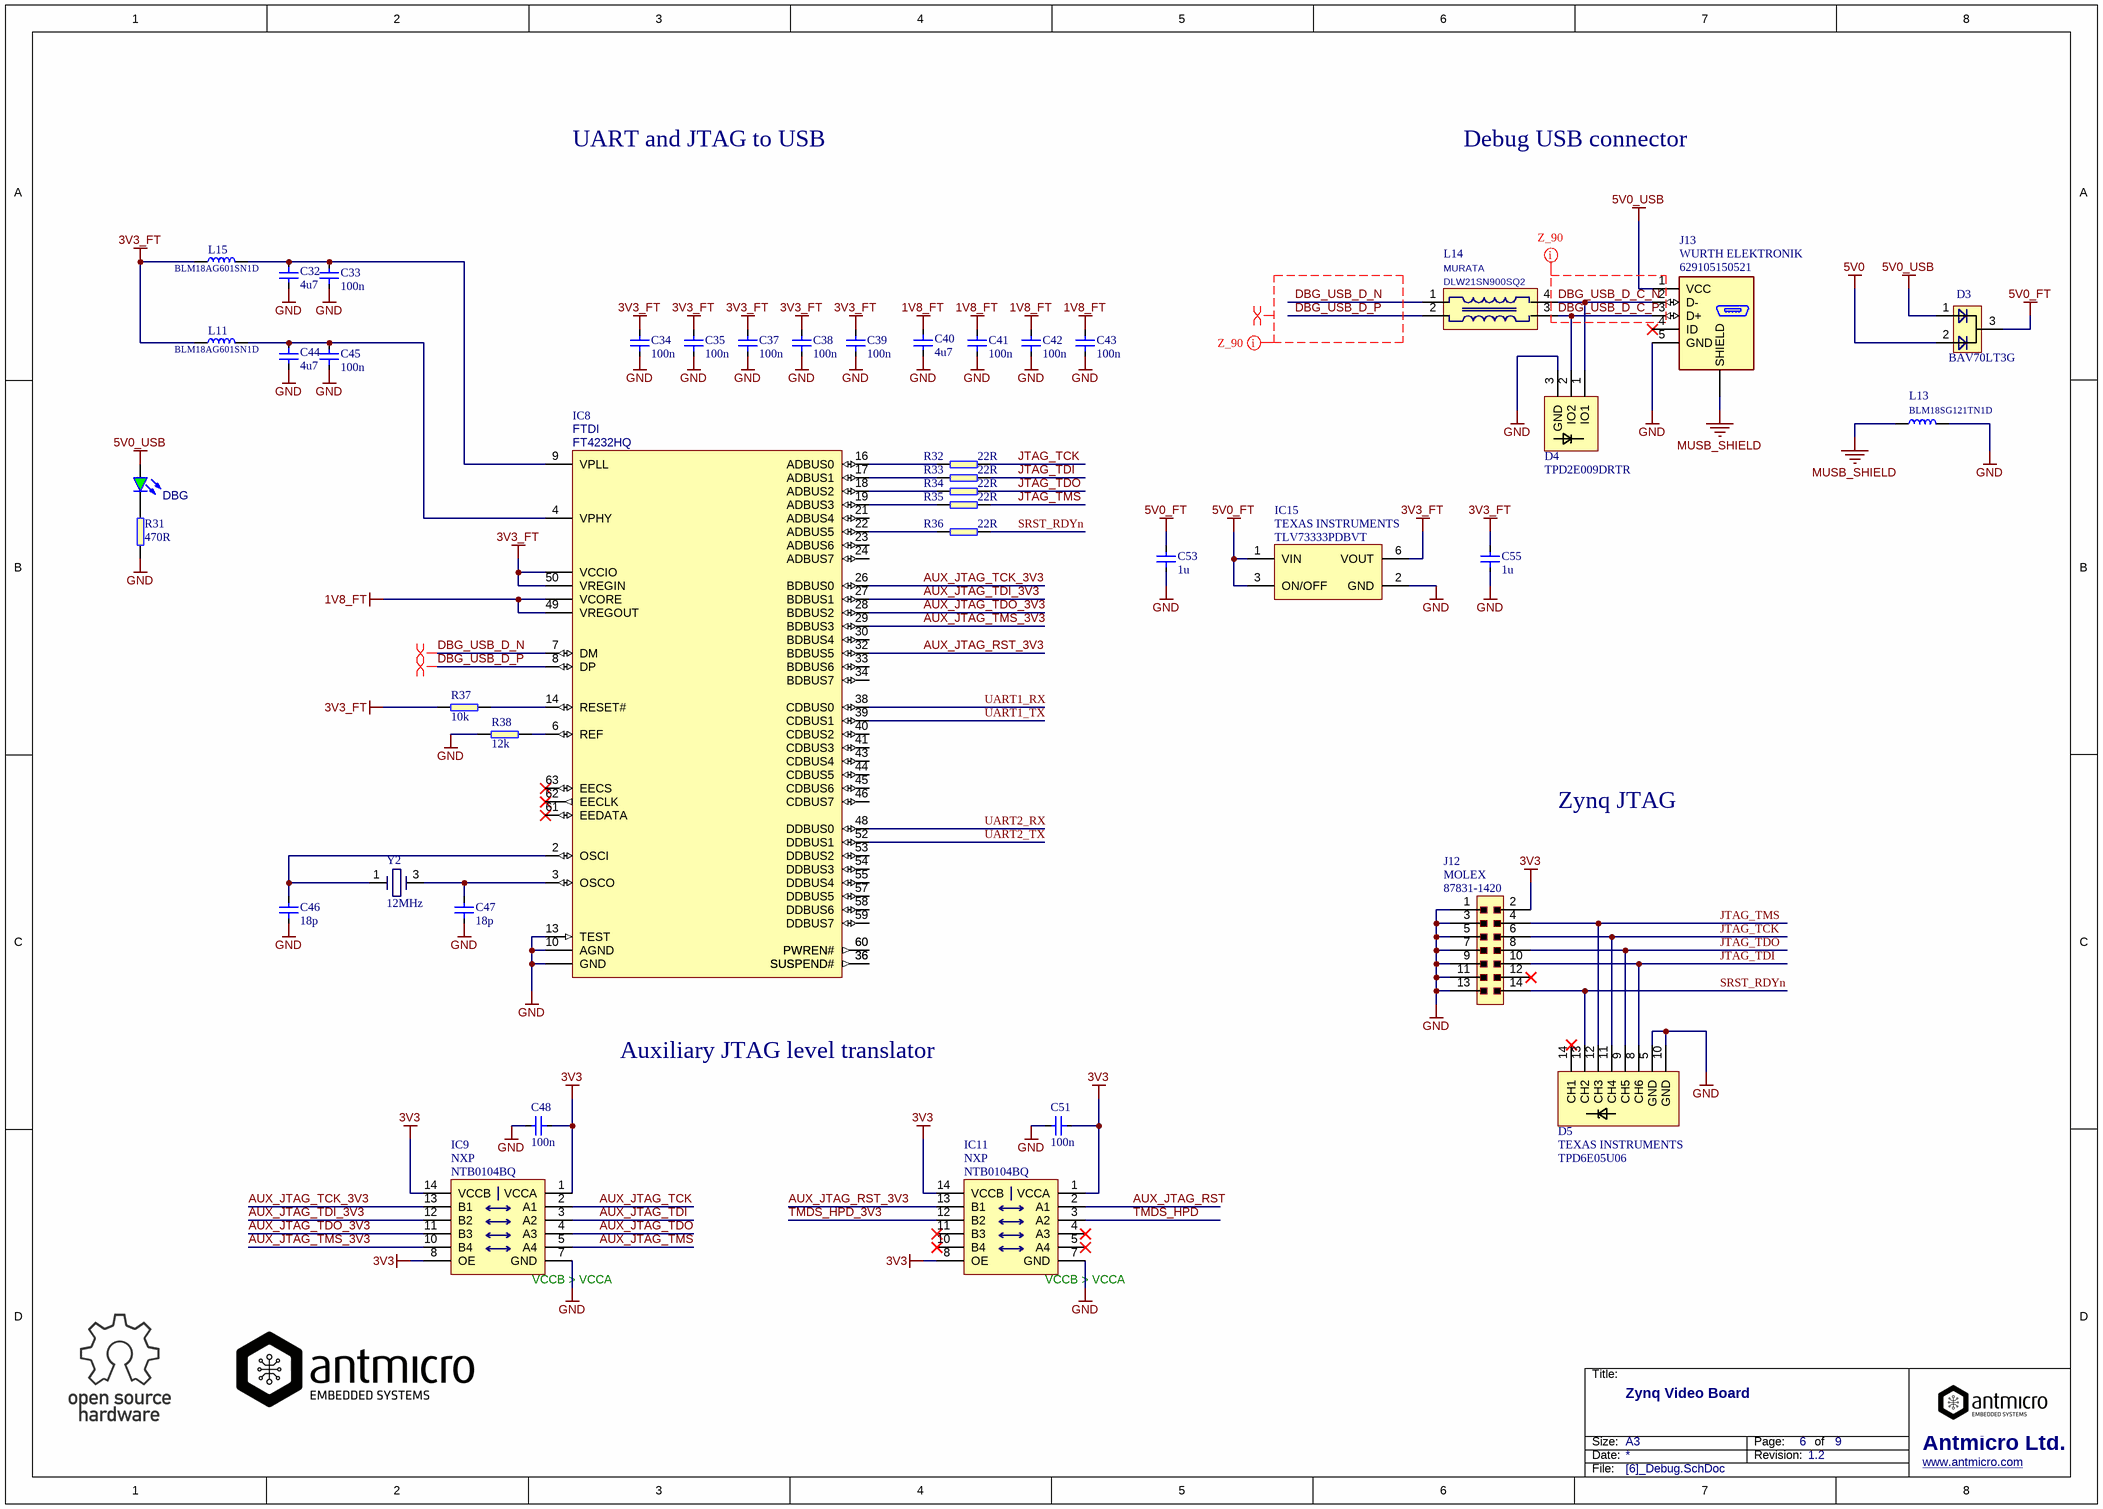
[diagram p5: [6]_Debug.SchDoc]

### Parts
C32  4u7  [0603]
C33  100n  [0402]
C34  100n  [0402]
C35  100n  [0402]
C37  100n  [0402]
C38  100n  [0402]
C39  100n  [0402]
C40  4u7  [0603]
C41  100n  [0402]
C42  100n  [0402]
C43  100n  [0402]
C44  4u7  [0603]
C45  100n  [0402]
C46  18p  [0402]
C47  18p  [0402]
C48  100n  [0402]
C51  100n  [0402]
C53  1u  [0603]
C55  1u  [0603]
D3  BAV70LT3G  [SOT-23]
D4  TPD2E009DRTR  [SOT-3]
D5  Manufacturer: TEXAS INSTRUMENTS  [TPD6E05U06_PASS]  (hidden comment: TPD6E05U06)
DBG  KPT-1608SGC  [LED0603]  (value not drawn)
IC8  Manufacturer: FTDI  [FT2232HQ]  (hidden comment: FT4232HQ)
IC9  Manufacturer: NXP  [DHVQFN14]  (hidden comment: NTB0104BQ)
IC11  Manufacturer: NXP  [DHVQFN14]  (hidden comment: NTB0104BQ)
IC15  TLV73333PDBVT  Manufacturer: TEXAS INSTRUMENTS  [SOT23-5N]
J12  Manufacturer: MOLEX  Part Symbol: 87831-1420  [CON-Molex-87831-1420]  (hidden comment: Molex-87831-1420)
J13  Manufacturer: WURTH ELEKTRONIK  Part Symbol: 629105150521  [WE_629105150521]
L11  BLM18AG601SN1D  [0603]
L13  BLM18SG121TN1D  [0603]
L14  Manufacturer: MURATA  [DLW21SN900SQ2]  (hidden comment: DLW21SN900SQ2)
L15  BLM18AG601SN1D  [0603]
R31  470R  [0402]
R32  22R  [0402]
R33  22R  [0402]
R34  22R  [0402]
R35  22R  [0402]
R36  22R  [0402]
R37  10k  [0402]
R38  12k  [0402]
Y2  12MHz  [QC3CA12]

### Nets
1V8_FT: C40.1 C41.2 C42.2 C43.2 IC8.49(VREGOUT) IC8.VCORE
3V3: C48.1 C51.1 IC9.1(VCCA) IC9.8(OE) IC9.14(VCCB) IC11.1(VCCA) IC11.8(OE) IC11.14(VCCB) J12.2
3V3_FT: C34.2 C35.2 C37.2 C38.2 C39.2 C55.2 IC8.50(VREGIN) IC8.VCCIO IC15.6(VOUT) L11.1 L15.1 R37.1
5V0: D3.2
5V0_FT: C53.2 D3.3 IC15.1(VIN) IC15.3(ON/OFF)
5V0_USB: D3.1 DBG.A J13.1(VCC)
GND: C32.2 C33.1 C34.1 C35.1 C37.1 C38.1 C39.1 C40.2 C41.1 C42.1 C43.1 C44.2 C45.1 C46.1 C47.1 C48.2 C51.2 C53.1 C55.1 D4.3(GND) D5.5(GND) D5.10(GND) IC8.10(AGND) IC8.13(TEST) IC8.GND IC9.7(GND) IC11.7(GND) IC15.2(GND) J12.1 J12.3 J12.5 J12.7 J12.9 J12.11 J12.13 J13.5(GND) L13.2 R31.1 R38.1 Y2.2 Y2.4
MUSB_SHIELD: J13.S(SHIELD) L13.1
AUX_JTAG_RST: IC11.2(A1)
AUX_JTAG_RST_3V3: IC8.32(BDBUS5) IC11.13(B1)
AUX_JTAG_TCK: IC9.2(A1)
AUX_JTAG_TCK_3V3: IC8.26(BDBUS0) IC9.13(B1)
AUX_JTAG_TDI: IC9.3(A2)
AUX_JTAG_TDI_3V3: IC8.27(BDBUS1) IC9.12(B2)
AUX_JTAG_TDO: IC9.4(A3)
AUX_JTAG_TDO_3V3: IC8.28(BDBUS2) IC9.11(B3)
AUX_JTAG_TMS: IC9.5(A4)
AUX_JTAG_TMS_3V3: IC8.29(BDBUS3) IC9.10(B4)
DBG_USB_D_C_N: D4.1(IO1) J13.2(D-) L14.4
DBG_USB_D_C_P: D4.2(IO2) J13.3(D+) L14.3
DBG_USB_D_N: IC8.7(DM) L14.1
DBG_USB_D_P: IC8.8(DP) L14.2
JTAG_TCK: D5.11(CH4) J12.6 R32.2
JTAG_TDI: D5.8(CH6) J12.10 R33.2
JTAG_TDO: D5.9(CH5) J12.8 R34.2
JTAG_TMS: D5.12(CH3) J12.4 R35.2
SRST_RDYn: D5.13(CH2) J12.14 R36.2
TMDS_HPD: IC11.3(A2)
TMDS_HPD_3V3: IC11.12(B2)
UART1_RX: IC8.38(CDBUS0)
UART1_TX: IC8.39(CDBUS1)
UART2_RX: IC8.48(DDBUS0)
UART2_TX: IC8.52(DDBUS1)
NetC32_1: C32.1 C33.2 IC8.9(VPLL) L15.2
NetC44_1: C44.1 C45.2 IC8.4(VPHY) L11.2
NetC46_2: C46.2 IC8.2(OSCI) Y2.1
NetC47_2: C47.2 IC8.3(OSCO) Y2.3
NetDBG_K: DBG.K R31.2
NetIC8_6: IC8.6(REF) R38.2
NetIC8_14: IC8.14(RESET#) R37.2
NetIC8_16: IC8.16(ADBUS0) R32.1
NetIC8_17: IC8.17(ADBUS1) R33.1
NetIC8_18: IC8.18(ADBUS2) R34.1
NetIC8_19: IC8.19(ADBUS3) R35.1
NetIC8_22: IC8.22(ADBUS5) R36.1

Not connected (* = marked no-connect by the designer): D5 14(CH1)*; IC8 21(ADBUS4) 23(ADBUS6) 24(ADBUS7) 30(BDBUS4) 33(BDBUS6) 34(BDBUS7) 36(SUSPEND#) 40(CDBUS2) 41(CDBUS3) 43(CDBUS4) 44(CDBUS5) 45(CDBUS6) 46(CDBUS7) 53(DDBUS2) 54(DDBUS3) 55(DDBUS4) 57(DDBUS5) 58(DDBUS6) 59(DDBUS7) 60(PWREN#) 61(EEDATA)* 62(EECLK)* 63(EECS)*; IC11 4(A3)* 5(A4)* 10(B4)* 11(B3)*; J12 12*; J13 4(ID)*

### Layout directives
differential pair: DBG_USB_D_N, DBG_USB_D_P
net class Z_90: DBG_USB_D_C_N, DBG_USB_D_C_P, DBG_USB_D_N, DBG_USB_D_P

### Notes on the sheet
- UART and JTAG to USB
- Debug USB connector
- Zynq JTAG
- Auxiliary JTAG level translator
- (near IC9) VCCB > VCCA
- (near IC11) VCCB > VCCA
- Title:
- Size:
- Date:
- A3
- Revision:
- Page:
- of
- Antmicro Ltd.
- File:
- www.antmicro.com

### Library data of the parts
C32 C40 C44 = C_4u7_0603: MLCC SMT Capacitor 4u7 0603; Manufacturer: MULTICOMP; Part Symbol: MC0603X475K6R3CT; Voltage: 6.3V; Part Number: C_4u7_0603; Value: 4u7
C33-C35 C37-C39 C41-C43 C45 C48 C51 = C_100n_0402: as C3 on sheet [1]_Power Supply; Part Number: C_100n_0402; Value: 100n
C46 C47 = C_18p_0402: as C26 on sheet [4]_USB; Part Number: C_18p_0402; Value: 18p
C53 C55 = C_1u_0603: as C18 on sheet [4]_USB; Part Number: C_1u_0603; Value: 1u
D3 = BAV70LT3G: Dual switching diode, common cathode; Manufacturer: ON SEMICONDUCTOR; Value: BAV70LT3G; Part Number: BAV70LT3G; Part Symbol: BAV70LT3G
D4 = TPD2E009: ESD Suppressors 2-CH; Manufacturer: TEXAS INSTRUMENTS; Part Number: TPD2E009DRTR; Value: TPD2E009DRTR; Part Symbol: TPD2E009DRTR
D5 = TPD6E05U06: as D12 on sheet [2]_Ethernet_SDCard; Part Number: TPD6E05U06_PASS; Value: TPD6E05U06
DBG = LED: as PWR_LED on sheet [1]_Power Supply; Value: KPT-1608SGC; Part Symbol: KPT-1608SGC
IC8 = FT4232HQ: FTDI  FT4232HQ-R  Interface Bridges, USB to UART, MPSSE, 1.62 V, 1.98 V, QFN, 64 Pins, -40 °C; Part Number: FT4232HQ; Value: FT4232HQ; Part Symbol: FT4232HQ-R
IC9 IC11 = NTB0104BQ: 4 bit voltage level translator - no pullups; Part Number: NTB0104BQ; Value: NTB0104BQ; Part Symbol: NTB0104BQ
IC15 = TLV73333PDBVT: Capacitor-Free, 300-mA, Low-Dropout Regulator with Foldback Current Limit for Portable Devices; Part Symbol: TLV73328PDBVT; Part Number: TLV73333PDBVT; Value: TLV73333PDBVT
J12 = CON-Molex-87831-1420: HEADER, SQUARE PIN, M/GRID, 14WAY; Part Number: CON-Molex-87831-1420; Value: Molex-87831-1420
J13 = Micro USB B: Part Number: WE_629105150521
L11 L15 = BLM18AG601SN1D: FERRITE BEAD, 0.38OHM, 0.5, 0603; Manufacturer: MURATA; Part Symbol: BLM18SG121TN1D; Part Number: BLM18AG601SN1D; Value: BLM18AG601SN1D
L13 = BLM18SG121TN1D: as L1 on sheet [1]_Power Supply; Part Number: BLM18SG121TN1D; Value: BLM18SG121TN1D; Part Symbol: BLM18SG121TN1D
L14 = DLW21SN900SQ2: as L8 on sheet [4]_USB; Part Number: DLW21SN900SQ2; Value: DLW21SN900SQ2
R31 = R_470R_0402: SMT Resistor 470R 0402; Manufacturer: VISHAY; Part Symbol: CRCW0402470RFKED; Tolerance: 1%; Value: 470R; Part Number: R_470R_0402
R32-R36 = R_22R_0402: SMT Resistor 22R 0402; Manufacturer: VISHAY; Part Symbol: CRCW040222R0FKED; Tolerance: 1%; Part Number: R_22R_0402; Value: 22R
R37 = R_10k_0402: as R10 on sheet [1]_Power Supply; Part Number: R_10k_0402; Value: 10k
R38 = R_12k_0402: as R13 on sheet [1]_Power Supply; Part Number: R_12k_0402; Value: 12k
Y2 = CRYSTAL_SMD_12Mhz: Crystal, 12 MHz, SMD, 3.2mm x 2.5mm, 30 ppm, 12 pF; Part Number: CRYSTAL_12MHz_3.2mm x2.5mm; Manufacturer: QANTEK TECHNOLOGY CORPORATION; Part Symbol: QC3CA12.0000F12B23M; Value: 12MHz

## Sheet [7]_CSI.SchDoc
size A3; DocumentNumber: 7; SheetNumber: 7; SheetTotal: 9; PageSetup: Record=PageOptions|CenterHorizontal=True|CenterVertical=True|PrintScale=0.97|XCorrection=1.00|YCorrection=1.00|PrintKind=1|BorderSize=5000000|LeftOffset=0|BottomOffset=0|Orientation=2|PaperLength=2970|PaperWidth=2100|Scale=100|PaperSource=7|PrintQuality=600|MediaType=1|DitherType=10|PaperKind=A4|PrintScaleMode=1
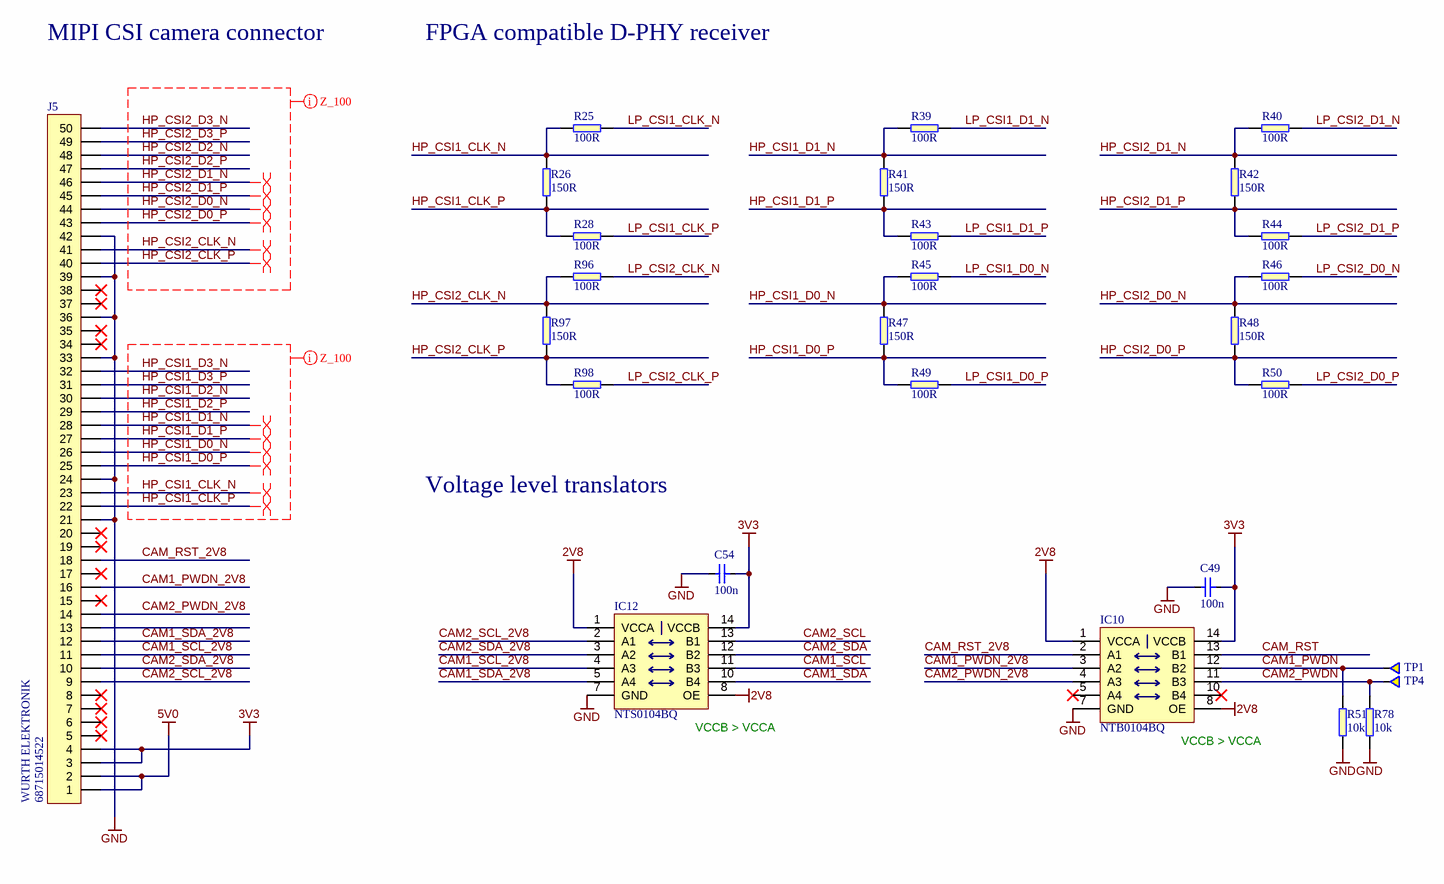
[diagram p6: [7]_CSI.SchDoc]

### Parts
C49  100n  [0402]
C54  100n  [0402]
IC10  NTB0104BQ  [DHVQFN14]
IC12  NTS0104BQ  [DHVQFN14]
J5  68715014522  Manufacturer: WURTH ELEKTRONIK  [68715014522_FLIPPED]
R25  100R  [0402]
R26  150R  [0402]
R28  100R  [0402]
R39  100R  [0402]
R40  100R  [0402]
R41  150R  [0402]
R42  150R  [0402]
R43  100R  [0402]
R44  100R  [0402]
R45  100R  [0402]
R46  100R  [0402]
R47  150R  [0402]
R48  150R  [0402]
R49  100R  [0402]
R50  100R  [0402]
R51  10k  [0402]
R78  10k  [0402]
R96  100R  [0402]
R97  150R  [0402]
R98  100R  [0402]
TP1  Testpad  [TP-R-2]  (value not drawn)  (no BOM)
TP4  Testpad  [TP-R-2]  (value not drawn)  (no BOM)

### Nets
2V8: IC10.1(VCCA) IC10.8(OE) IC12.1(VCCA) IC12.8(OE)
3V3: C49.1 C54.1 IC10.14(VCCB) IC12.14(VCCB) J5.3 J5.4
5V0: J5.1 J5.2
GND: C49.2 C54.2 IC10.7(GND) IC12.7(GND) J5.21 J5.24 J5.33 J5.36 J5.39 J5.42 R51.1 R78.1
CAM1_PWDN: IC10.12(B2) R51.2 TP1.1
CAM1_PWDN_2V8: IC10.3(A2) J5.16
CAM1_SCL: IC12.11(B3)
CAM1_SCL_2V8: IC12.4(A3) J5.11
CAM1_SDA: IC12.10(B4)
CAM1_SDA_2V8: IC12.5(A4) J5.12
CAM2_PWDN: IC10.11(B3) R78.2 TP4.1
CAM2_PWDN_2V8: IC10.4(A3) J5.14
CAM2_SCL: IC12.13(B1)
CAM2_SCL_2V8: IC12.2(A1) J5.9
CAM2_SDA: IC12.12(B2)
CAM2_SDA_2V8: IC12.3(A2) J5.10
CAM_RST: IC10.13(B1)
CAM_RST_2V8: IC10.2(A1) J5.18
HP_CSI1_CLK_N: J5.23 R25.1 R26.2
HP_CSI1_CLK_P: J5.22 R26.1 R28.1
HP_CSI1_D0_N: J5.26 R45.1 R47.2
HP_CSI1_D0_P: J5.25 R47.1 R49.1
HP_CSI1_D1_N: J5.28 R39.1 R41.2
HP_CSI1_D1_P: J5.27 R41.1 R43.1
HP_CSI1_D2_N: J5.30
HP_CSI1_D2_P: J5.29
HP_CSI1_D3_N: J5.32
HP_CSI1_D3_P: J5.31
HP_CSI2_CLK_N: J5.41 R96.1 R97.2
HP_CSI2_CLK_P: J5.40 R97.1 R98.1
HP_CSI2_D0_N: J5.44 R46.1 R48.2
HP_CSI2_D0_P: J5.43 R48.1 R50.1
HP_CSI2_D1_N: J5.46 R40.1 R42.2
HP_CSI2_D1_P: J5.45 R42.1 R44.1
HP_CSI2_D2_N: J5.48
HP_CSI2_D2_P: J5.47
HP_CSI2_D3_N: J5.50
HP_CSI2_D3_P: J5.49
LP_CSI1_CLK_N: R25.2
LP_CSI1_CLK_P: R28.2
LP_CSI1_D0_N: R45.2
LP_CSI1_D0_P: R49.2
LP_CSI1_D1_N: R39.2
LP_CSI1_D1_P: R43.2
LP_CSI2_CLK_N: R96.2
LP_CSI2_CLK_P: R98.2
LP_CSI2_D0_N: R46.2
LP_CSI2_D0_P: R50.2
LP_CSI2_D1_N: R40.2
LP_CSI2_D1_P: R44.2

Not connected (* = marked no-connect by the designer): IC10 5(A4)* 10(B4)*; J5 5* 6* 7* 8* 13 15* 17* 19* 20* 34* 35* 37* 38*

### Layout directives
differential pair: HP_CSI1_CLK_N, HP_CSI1_CLK_P, HP_CSI1_D0_N, HP_CSI1_D0_P, HP_CSI1_D1_N, HP_CSI1_D1_P, HP_CSI2_CLK_N, HP_CSI2_CLK_P, HP_CSI2_D0_N, HP_CSI2_D0_P, HP_CSI2_D1_N, HP_CSI2_D1_P
Z_100: 100: HP_CSI1_CLK_N, HP_CSI1_CLK_P, HP_CSI1_D0_N, HP_CSI1_D0_P, HP_CSI1_D1_N, HP_CSI1_D1_P, HP_CSI1_D2_N, HP_CSI1_D2_P, HP_CSI1_D3_N, HP_CSI1_D3_P, HP_CSI2_CLK_N, HP_CSI2_CLK_P, HP_CSI2_D0_N, HP_CSI2_D0_P, HP_CSI2_D1_N, HP_CSI2_D1_P, HP_CSI2_D2_N, HP_CSI2_D2_P, HP_CSI2_D3_N, HP_CSI2_D3_P

### Notes on the sheet
- MIPI CSI camera connector
- FPGA compatible D-PHY receiver
- Voltage level translators
- (near IC12) VCCB > VCCA
- (near IC10) VCCB > VCCA
- Title:
- Size:
- Date:
- A3
- Revision:
- Page:
- of
- Antmicro Ltd.
- File:
- www.antmicro.com

### Library data of the parts
C49 C54 = C_100n_0402: as C3 on sheet [1]_Power Supply; Part Number: C_100n_0402; Value: 100n
IC10 = NTB0104BQ: 4 bit voltage level translator - no pullups; Manufacturer: NXP; Part Number: NTB0104BQ; Value: NTB0104BQ; Part Symbol: NTB0104BQ
IC12 = NTS0104BQ: 4 bit voltage level translator - pullups; Manufacturer: NXP; Value: NTS0104BQ; Part Number: NTS0104BQ; Part Symbol: NTS0104BQ
J5 = 1X50: 0.50mm SMT ZIF Horizontal Bottom Contact WR-FPC; Part Number: WE-687-150-145-22_FLIPPED; Value: 68715014522; Part Symbol: 68715014522
R25 R28 R39 R40 R43-R46 R49 R50 R96 R98 = R_100R_0402: SMT Resistor 100R 0402; Manufacturer: BOURNS; Part Symbol: CR0402-FX-1000GLF; Tolerance: 1%; Part Number: R_100R_0402; Value: 100R
R26 R41 R42 R47 R48 R97 = R_150R_0402: as R60 on sheet [2]_Ethernet_SDCard; Part Number: R_150R_0402; Value: 150R
R51 R78 = R_10k_0402: as R10 on sheet [1]_Power Supply; Part Number: R_10k_0402; Value: 10k
TP1 TP4 = Testpad: Testpad, round, 2mm; Part Number: TP-R-2

## Sheet [8]_Peripherals.SchDoc
size A3; DocumentNumber: 8; SheetNumber: 8; SheetTotal: 9; PageSetup: Record=PageOptions|CenterHorizontal=True|CenterVertical=True|PrintScale=0.97|XCorrection=1.00|YCorrection=1.00|PrintKind=1|BorderSize=5000000|LeftOffset=0|BottomOffset=0|Orientation=2|PaperLength=2970|PaperWidth=2100|Scale=100|PaperSource=7|PrintQuality=600|MediaType=1|DitherType=10|PaperKind=A4|PrintScaleMode=1
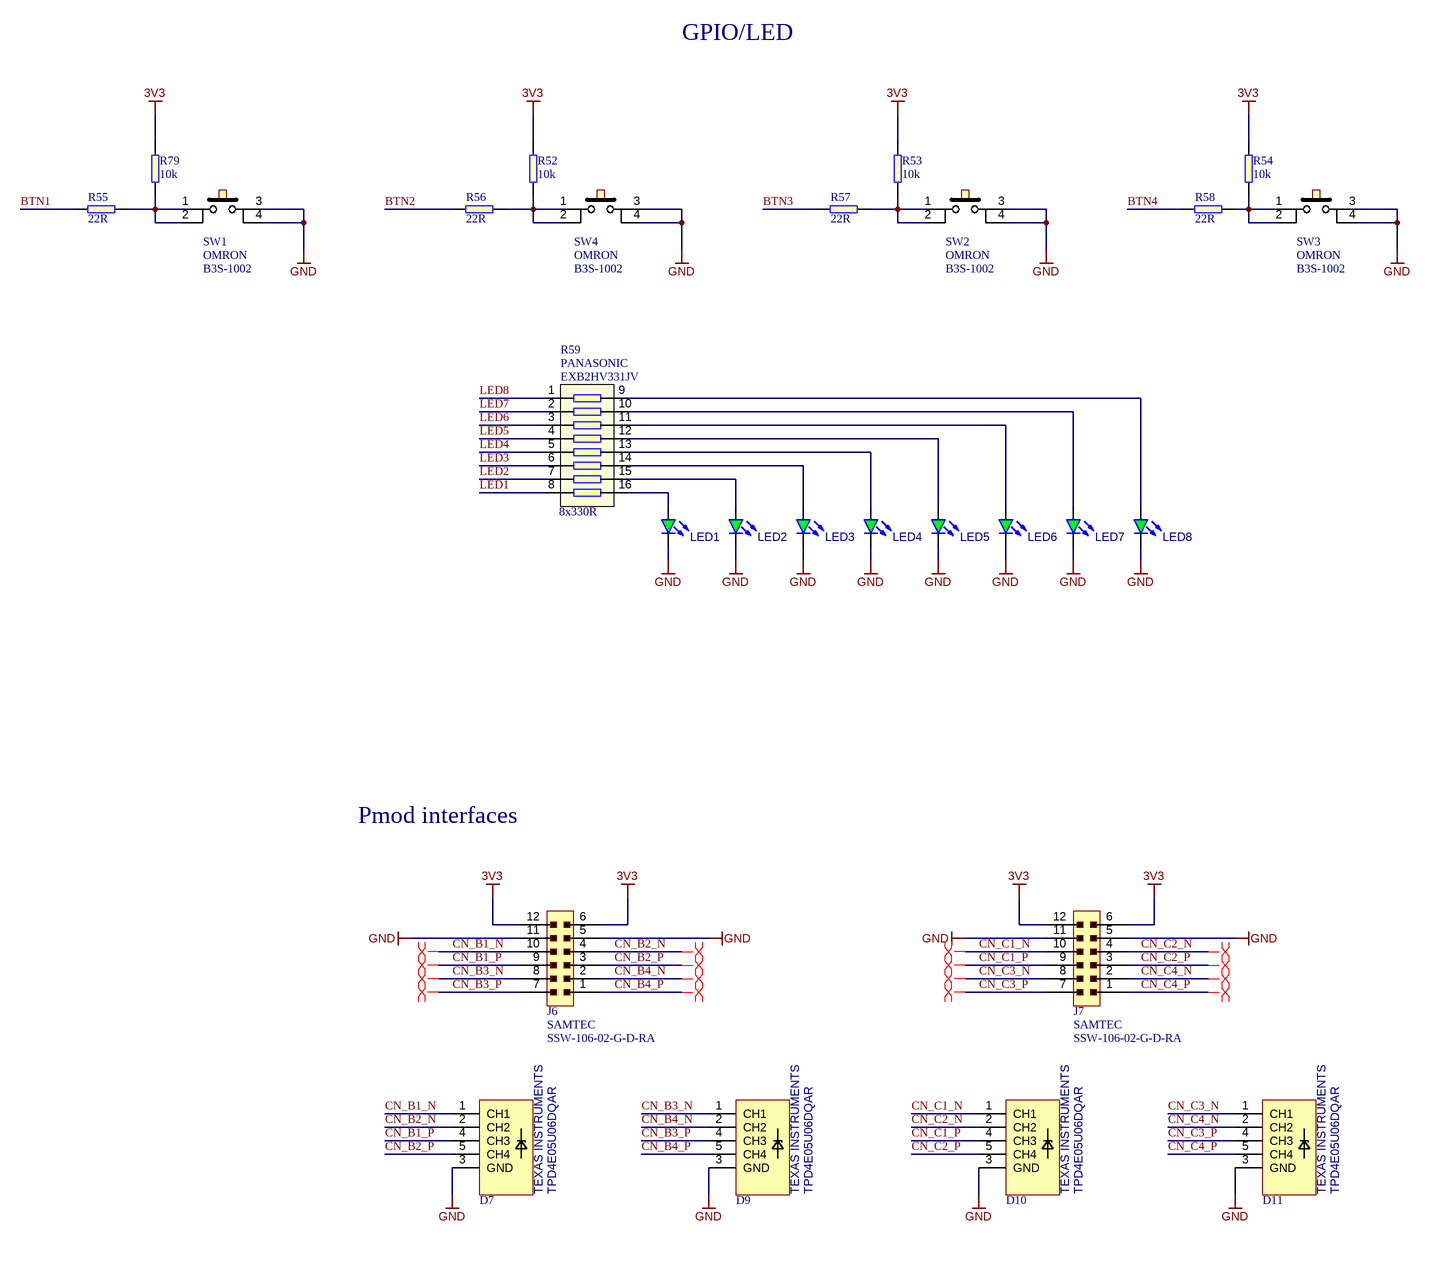
[diagram p7: [8]_Peripherals.SchDoc]

### Parts
D7  Manufacturer: TEXAS INSTRUMENTS  Part Symbol: TPD4E05U06DQAR  [TPD4E05U06_PASS]  (hidden comment: TPD4E05U06)
D9  Manufacturer: TEXAS INSTRUMENTS  Part Symbol: TPD4E05U06DQAR  [TPD4E05U06_PASS]  (hidden comment: TPD4E05U06)
D10  Manufacturer: TEXAS INSTRUMENTS  Part Symbol: TPD4E05U06DQAR  [TPD4E05U06_PASS]  (hidden comment: TPD4E05U06)
D11  Manufacturer: TEXAS INSTRUMENTS  Part Symbol: TPD4E05U06DQAR  [TPD4E05U06_PASS]  (hidden comment: TPD4E05U06)
J6  Manufacturer: SAMTEC  [SSW-106-02-G-D-RA]  (hidden comment: SSW-106-02-G-D-RA)
J7  Manufacturer: SAMTEC  [SSW-106-02-G-D-RA]  (hidden comment: SSW-106-02-G-D-RA)
LED1  KPT-1608SGC  [LED0603]  (value not drawn)
LED2  KPT-1608SGC  [LED0603]  (value not drawn)
LED3  KPT-1608SGC  [LED0603]  (value not drawn)
LED4  KPT-1608SGC  [LED0603]  (value not drawn)
LED5  KPT-1608SGC  [LED0603]  (value not drawn)
LED6  KPT-1608SGC  [LED0603]  (value not drawn)
LED7  KPT-1608SGC  [LED0603]  (value not drawn)
LED8  KPT-1608SGC  [LED0603]  (value not drawn)
R52  10k  [0402]
R53  10k  [0402]
R54  10k  [0402]
R55  22R  [0402]
R56  22R  [0402]
R57  22R  [0402]
R58  22R  [0402]
R59  8x330R  Manufacturer: PANASONIC  Part Symbol: EXB2HV331JV  [R_ARRAY_0402]
R79  10k  [0402]
SW1  Manufacturer: OMRON  [B3S-100X]  (hidden comment: B3S-1002)
SW2  Manufacturer: OMRON  [B3S-100X]  (hidden comment: B3S-1002)
SW3  Manufacturer: OMRON  Part Symbol: B3S-1002  [B3S-100X]  (hidden comment: B3S-100X)
SW4  Manufacturer: OMRON  Part Symbol: B3S-1002  [B3S-100X]  (hidden comment: B3S-100X)

### Nets
3V3: J6.6 J6.12 J7.6 J7.12 R52.2 R53.2 R54.2 R79.2
GND: D7.3(GND) D9.3(GND) D10.3(GND) D11.3(GND) J6.5 J6.11 J7.5 J7.11 LED1.K LED2.K LED3.K LED4.K LED5.K LED6.K LED7.K LED8.K SW1.3 SW1.4 SW2.3 SW2.4 SW3.3 SW3.4 SW4.3 SW4.4
BTN1: R55.1
BTN2: R56.1
BTN3: R57.1
BTN4: R58.1
CN_B1_N: D7.1(CH1) J6.10
CN_B1_P: D7.4(CH3) J6.9
CN_B2_N: D7.2(CH2) J6.4
CN_B2_P: D7.5(CH4) J6.3
CN_B3_N: D9.1(CH1) J6.8
CN_B3_P: D9.4(CH3) J6.7
CN_B4_N: D9.2(CH2) J6.2
CN_B4_P: D9.5(CH4) J6.1
CN_C1_N: D10.1(CH1) J7.10
CN_C1_P: D10.4(CH3) J7.9
CN_C2_N: D10.2(CH2) J7.4
CN_C2_P: D10.5(CH4) J7.3
CN_C3_N: D11.1(CH1) J7.8
CN_C3_P: D11.4(CH3) J7.7
CN_C4_N: D11.2(CH2) J7.2
CN_C4_P: D11.5(CH4) J7.1
LED1: R59.8
LED2: R59.7
LED3: R59.6
LED4: R59.5
LED5: R59.4
LED6: R59.3
LED7: R59.2
LED8: R59.1
NetLED1_A: LED1.A R59.16
NetLED2_A: LED2.A R59.15
NetLED3_A: LED3.A R59.14
NetLED4_A: LED4.A R59.13
NetLED5_A: LED5.A R59.12
NetLED6_A: LED6.A R59.11
NetLED7_A: LED7.A R59.10
NetLED8_A: LED8.A R59.9
NetR52_1: R52.1 R56.2 SW4.1 SW4.2
NetR53_1: R53.1 R57.2 SW2.1 SW2.2
NetR54_1: R54.1 R58.2 SW3.1 SW3.2
NetR55_2: R55.2 R79.1 SW1.1 SW1.2

### Layout directives
differential pair: CN_B1_N, CN_B1_P, CN_B2_N, CN_B2_P, CN_B3_N, CN_B3_P, CN_B4_N, CN_B4_P, CN_C1_N, CN_C1_P, CN_C2_N, CN_C2_P, CN_C3_N, CN_C3_P, CN_C4_N, CN_C4_P

### Notes on the sheet
- GPIO/LED
- Pmod interfaces
- Title:
- Size:
- Date:
- A3
- Revision:
- Page:
- of
- Antmicro Ltd.
- File:
- www.antmicro.com

### Library data of the parts
D7 D9-D11 = TPD4E05U06: ESD Suppressors 4-CH; Part Number: TPD4E05U06_PASS; Value: TPD4E05U06
J6 J7 = SSW-106-02-G-D-RA: Board-To-Board Connector, Right Angle, 2.54 mm, 12 Contacts, Receptacle, SSW Series, Through Hole; Part Number: SSW-106-02-G-D-RA; Value: SSW-106-02-G-D-RA; Part Symbol: SSW-106-02-G-D-RA
LED1-LED8 = LED: as PWR_LED on sheet [1]_Power Supply; Value: KPT-1608SGC; Part Symbol: KPT-1608SGC
R52-R54 R79 = R_10k_0402: as R10 on sheet [1]_Power Supply; Part Number: R_10k_0402; Value: 10k
R55-R58 = R_22R_0402: as R32 on sheet [6]_Debug; Part Number: R_22R_0402; Value: 22R
R59 = R_ARRAY: SMD Resistors Array 0402; Part Number: Resistor Array_8x330R_0402; Tolerance: 5%; Value: 8x330R
SW1-SW4 = TACTILE_SWITCH: Tactile switch; Part Number: B3S-1002
  SW1 SW2: Value: B3S-1002; Part Symbol: B3S-1002
  SW3 SW4: Value: B3S-100X

## Sheet [9]_ID_Serial.SchDoc
size A3; DocumentNumber: 9; SheetNumber: 9; SheetTotal: 9; PageSetup: Record=PageOptions|CenterHorizontal=True|CenterVertical=True|PrintScale=0.97|XCorrection=1.00|YCorrection=1.00|PrintKind=1|BorderSize=5000000|LeftOffset=0|BottomOffset=0|Orientation=2|PaperLength=2970|PaperWidth=2100|Scale=100|PaperSource=7|PrintQuality=600|MediaType=1|DitherType=10|PaperKind=A4|PrintScaleMode=1
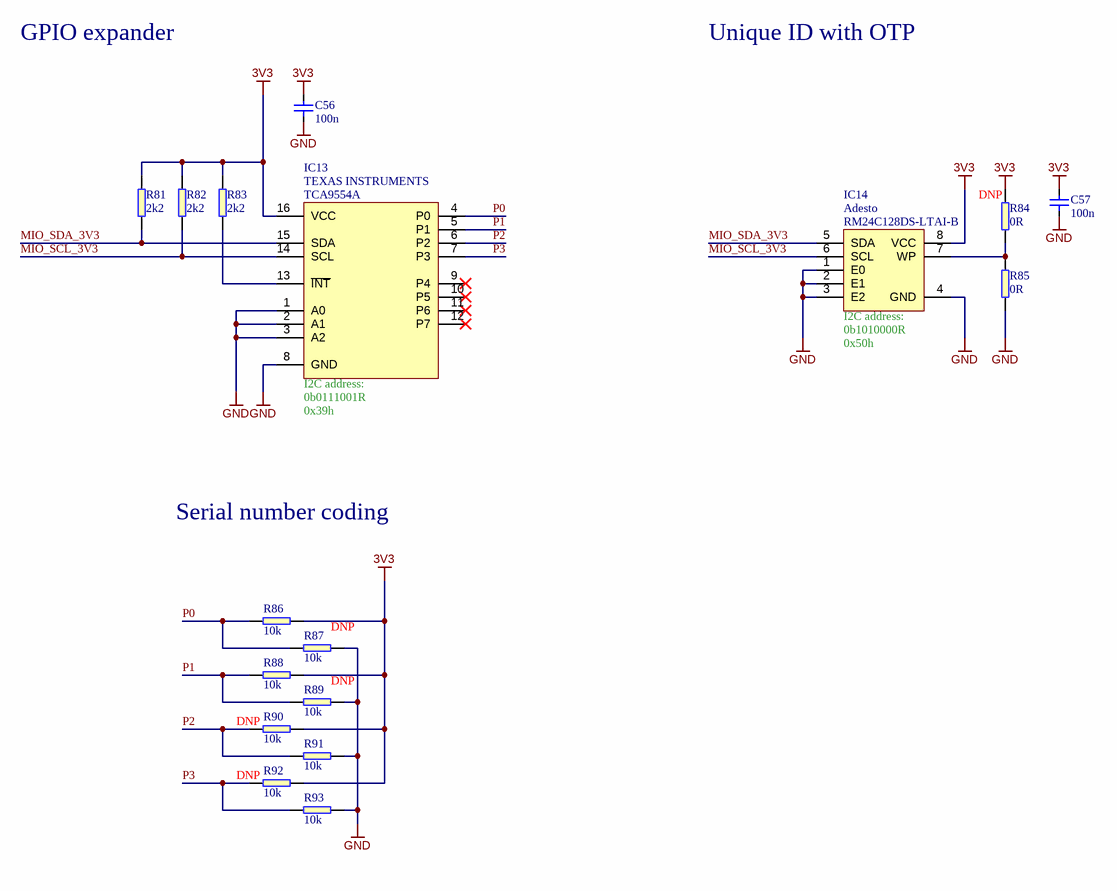
[diagram p8: [9]_ID_Serial.SchDoc]

### Parts
C56  100n  [0402]
C57  100n  [0402]
IC13  Manufacturer: TEXAS INSTRUMENTS  [DBQ0016A]  (hidden comment: TCA9554A)
IC14  Manufacturer: Adesto  [TSSOP-8]  (hidden comment: RM24C128DS-LTAI-B)
R81  2k2  [0402]
R82  2k2  [0402]
R83  2k2  [0402]
R84  0R  [0402]
R85  0R  [0402]
R86  10k  [0402]
R87  10k  [0402]
R88  10k  [0402]
R89  10k  [0402]
R90  10k  [0402]
R91  10k  [0402]
R92  10k  [0402]
R93  10k  [0402]

### Nets
3V3: C56.2 C57.2 IC13.16(VCC) IC14.8(VCC) R81.2 R82.2 R83.2 R84.2 R86.2 R88.2 R90.2 R92.2
GND: C56.1 C57.1 IC13.1(A0) IC13.2(A1) IC13.3(A2) IC13.8(GND) IC14.1(E0) IC14.2(E1) IC14.3(E2) IC14.4(GND) R85.1 R87.2 R89.2 R91.2 R93.2
MIO_SCL_3V3: IC13.14(SCL) IC14.6(SCL) R82.1
MIO_SDA_3V3: IC13.15(SDA) IC14.5(SDA) R81.1
P0: IC13.4(P0) R86.1 R87.1
P1: IC13.5(P1) R88.1 R89.1
P2: IC13.6(P2) R90.1 R91.1
P3: IC13.7(P3) R92.1 R93.1
NetIC13_13: IC13.13(~{INT}) R83.1
NetIC14_7: IC14.7(WP) R84.1 R85.2

Not connected (* = marked no-connect by the designer): IC13 9(P4)* 10(P5)* 11(P6)* 12(P7)*

### Notes on the sheet
- GPIO expander
- Unique ID with OTP
- (near R84) DNP
- (near IC14) 0b1010000R
- (near IC14) 0x50h
- (near IC14) I2C address:
- (near IC13) 0b0111001R
- (near IC13) 0x39h
- (near IC13) I2C address:
- Serial number coding
- (near R87) DNP
- (near R89) DNP
- (near R90) DNP
- (near R92) DNP
- Title:
- Size:
- Date:
- A3
- Revision:
- Page:
- of
- Antmicro Ltd.
- File:
- www.antmicro.com

### Library data of the parts
C56 C57 = C_100n_0402: as C3 on sheet [1]_Power Supply; Part Number: C_100n_0402; Value: 100n
IC13 = TCA9554A: Remote 8bit I2C SMBus I/O expander; Part Number: TCA9554A; Value: TCA9554A; Part Symbol: TCA9554A
IC14 = RM24C128DS: EEPROM with UID and OTP registers.; Part Number: RM24C128DS; Value: RM24C128DS-LTAI-B; Part Symbol: RM24C128DS-LTAI-B
R81-R83 = R_2k2_0402: SMT Resistor 2k2 0402; Manufacturer: MULTICOMP; Part Symbol: MCWR04X2201FTL; Tolerance: 5%; Part Number: R_2k2_0402; Value: 2k2
R84 R85 = R_0R_0402: as R7 on sheet [3]_SO-DIMM; Part Number: R_0R_0402; Value: 0R
R86-R93 = R_10k_0402: as R10 on sheet [1]_Power Supply; Part Number: R_10k_0402; Value: 10k